# Altium project SmartHaloFF.PrjPcb (part 1 of 2)
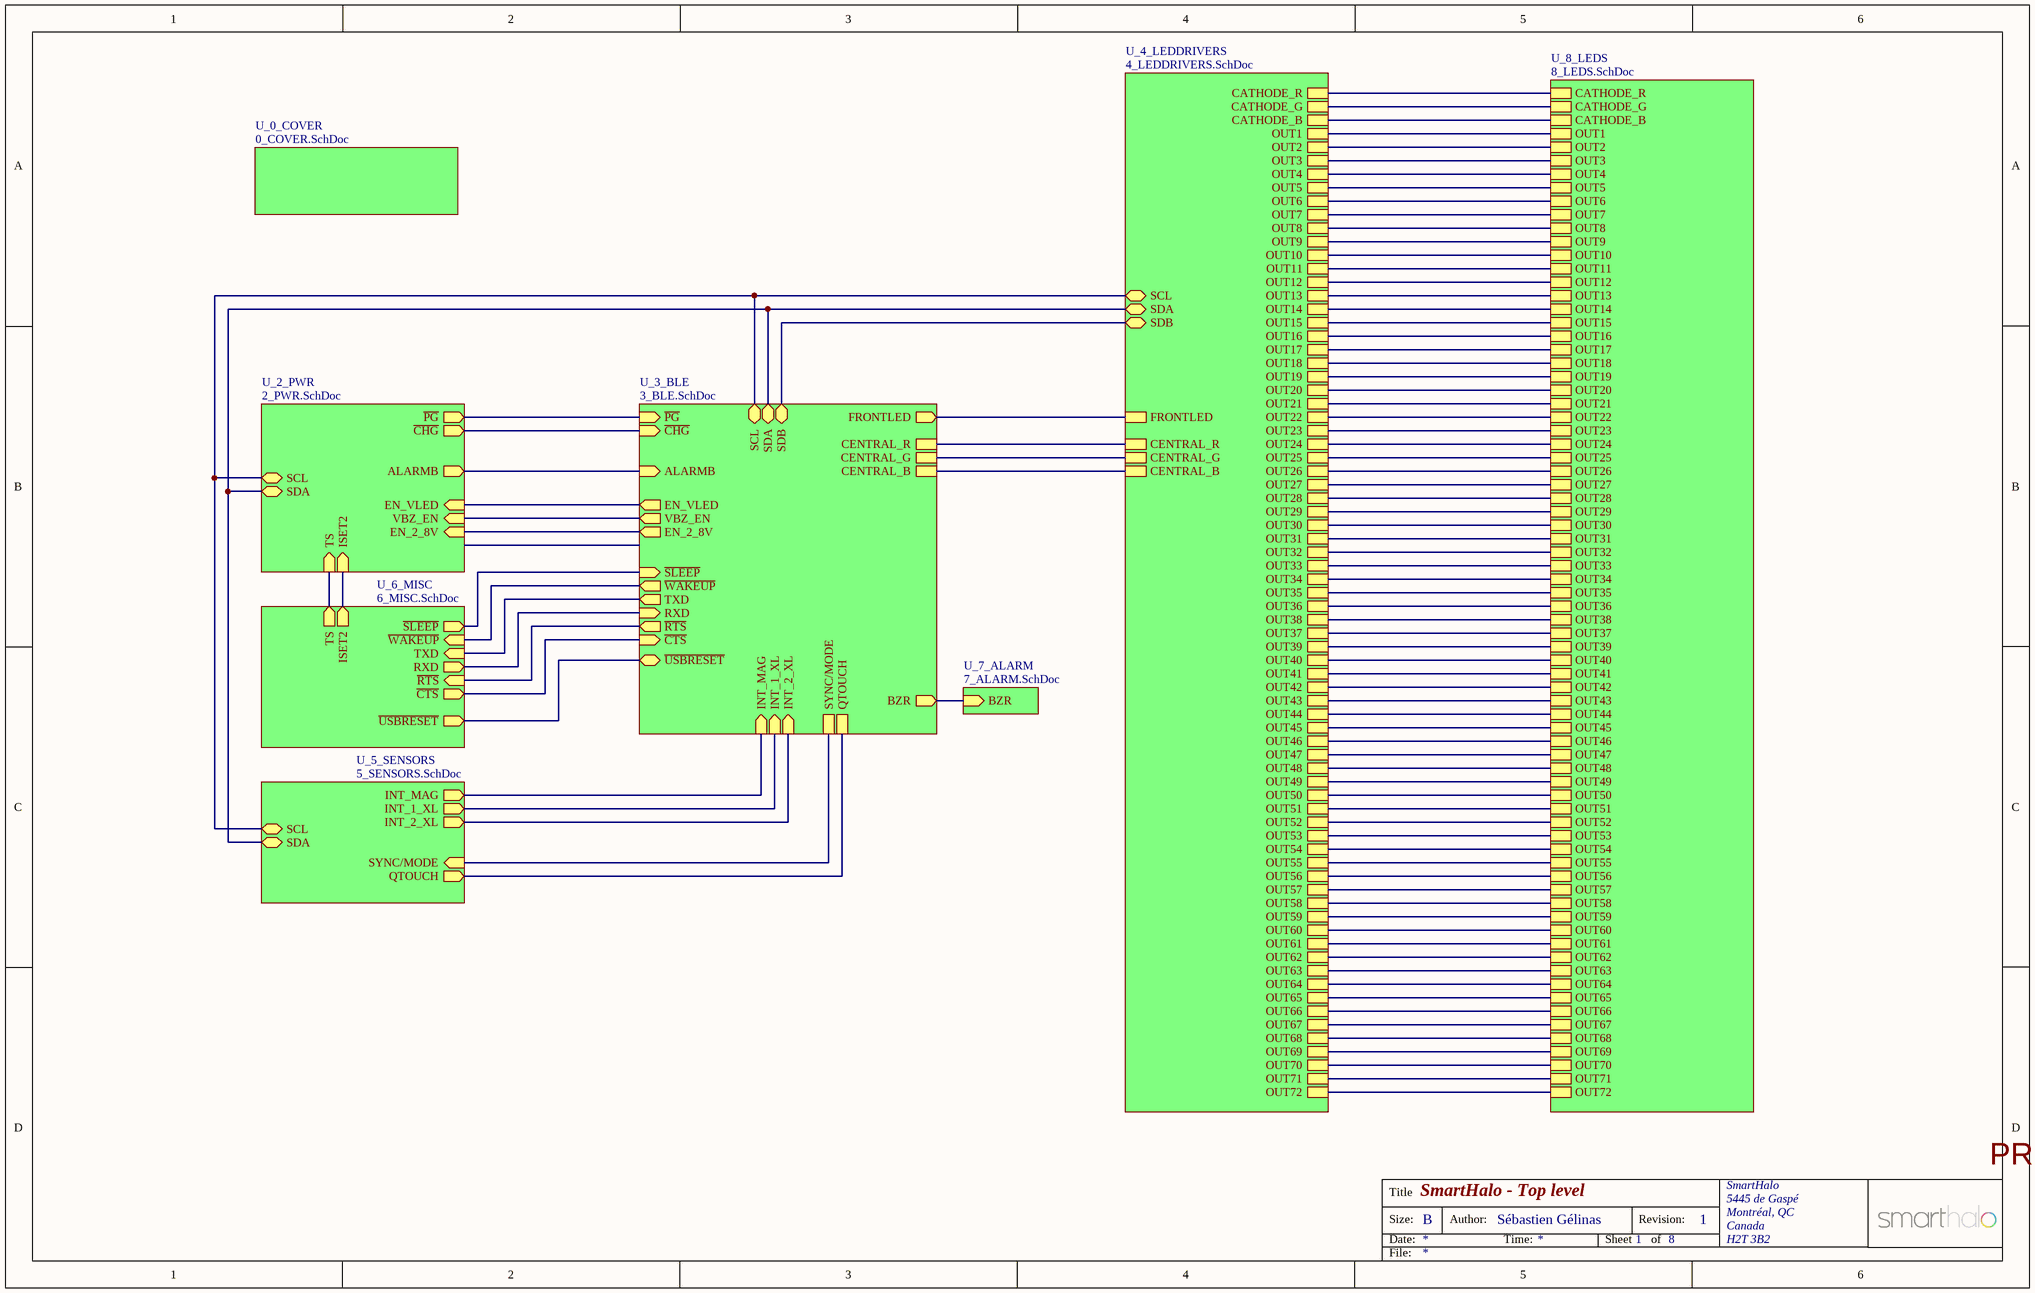
[diagram p0: 1_TOP.SchDoc]
ApprovedBy: Olivier Bourbonnais
9 sheets, 370 parts. Net scope: hierarchical (ports join the sheet entries above them; power ports are global).
Board file: SmartHaloFF.PcbDoc
Sheets:
  1_TOP.SchDoc
    U_2_PWR = 2_PWR.SchDoc
    U_3_BLE = 3_BLE.SchDoc
    U_4_LEDDRIVERS = 4_LEDDRIVERS.SchDoc
    U_5_SENSORS = 5_SENSORS.SchDoc
    U_6_MISC = 6_MISC.SchDoc
    U_7_ALARM = 7_ALARM.SchDoc
    U_8_LEDS = 8_LEDS.SchDoc
    U_0_COVER = 0_COVER.SchDoc

## Sheet 1_TOP.SchDoc: SmartHalo - Top level
size B; Author: Sébastien Gélinas; Organization: SmartHalo; Address1: 5445 de Gaspé; Address2: Montréal, QC; Address3: Canada; Address4: H2T 3B2; DocumentNumber: 1; Revision: 1; SheetNumber: 1; SheetTotal: 8

### Sub-sheets
U_0_COVER = 0_COVER.SchDoc: no entries
U_2_PWR = 2_PWR.SchDoc: VBZ_EN (in), ISET2 (in), ~{PG} (out), ~{CHG} (out), EN_VLED (in), EN_2_8V (in), SCL (bidir), SDA (bidir), ALARMB (out), TS (in)
U_3_BLE = 3_BLE.SchDoc: SDA (bidir), SDB (bidir), BZR (out), FRONTLED (out), SCL (bidir), VBZ_EN (out), ~{CHG} (in), ~{PG} (in), ~{WAKEUP} (out), EN_VLED (out), EN_2_8V (out), QTOUCH, ALARMB (in), CENTRAL_R, CENTRAL_G, CENTRAL_B, INT_MAG (in), INT_1_XL (in), INT_2_XL (in), SYNC/MODE, ~{SLEEP} (in), RXD (in), TXD (out), ~{CTS} (in), ~{RTS} (out), ~{USBRESET}
U_4_LEDDRIVERS = 4_LEDDRIVERS.SchDoc: FRONTLED, SDA (bidir), SDB (bidir), SCL (bidir), CATHODE_B, CATHODE_G, CATHODE_R, OUT1, OUT2, OUT3, OUT4, OUT5, OUT6, OUT7, OUT8, OUT9, OUT10, OUT11, OUT12, OUT13, OUT14, OUT15, OUT16, OUT17, OUT18, OUT19, OUT20, OUT21, OUT22, OUT23, OUT24, OUT25, OUT26, OUT27, OUT28, OUT29, OUT30, OUT31, OUT32, OUT33, OUT34, OUT35, OUT36, OUT38, OUT37, OUT39, OUT40, OUT41, OUT42, OUT43, OUT44, OUT45, OUT46, OUT47, OUT48, OUT49, OUT50, OUT51, OUT52, OUT53, OUT54, OUT55, OUT56, OUT57, OUT58, OUT59, OUT60, OUT61, OUT62, OUT63, OUT64, OUT65, OUT66, OUT67, OUT69, OUT70, OUT71, OUT72, OUT68, CENTRAL_R, CENTRAL_G, CENTRAL_B
U_5_SENSORS = 5_SENSORS.SchDoc: SCL (bidir), SDA (bidir), INT_MAG (out), INT_2_XL (out), QTOUCH (out), SYNC/MODE (in), INT_1_XL (out)
U_6_MISC = 6_MISC.SchDoc: TXD (in), RXD (out), ~{WAKEUP} (in), ~{CTS} (out), ~{RTS} (in), ISET2 (out), TS (out), ~{USBRESET} (out), ~{SLEEP} (out)
U_7_ALARM = 7_ALARM.SchDoc: BZR (in)
U_8_LEDS = 8_LEDS.SchDoc: CATHODE_B, CATHODE_G, CATHODE_R, OUT1, OUT2, OUT3, OUT4, OUT5, OUT6, OUT7, OUT8, OUT9, OUT10, OUT11, OUT12, OUT13, OUT14, OUT15, OUT16, OUT17, OUT18, OUT19, OUT20, OUT21, OUT22, OUT23, OUT24, OUT25, OUT26, OUT27, OUT28, OUT29, OUT30, OUT31, OUT32, OUT33, OUT34, OUT35, OUT36, OUT38, OUT37, OUT39, OUT40, OUT41, OUT42, OUT43, OUT44, OUT45, OUT46, OUT47, OUT48, OUT49, OUT50, OUT51, OUT52, OUT53, OUT54, OUT55, OUT56, OUT57, OUT58, OUT59, OUT60, OUT61, OUT62, OUT63, OUT64, OUT65, OUT66, OUT67, OUT69, OUT70, OUT71, OUT72, OUT68

### Nets
ALARMB: sheet U_2_PWR/ALARMB, sheet U_3_BLE/ALARMB
BCD1: sheet U_2_PWR/ISET2, sheet U_6_MISC/ISET2
BZR: sheet U_3_BLE/BZR, sheet U_7_ALARM/BZR
~{CHG}: sheet U_2_PWR/~{CHG}, sheet U_3_BLE/~{CHG}
CATHODE_B: sheet U_4_LEDDRIVERS/CATHODE_B, sheet U_8_LEDS/CATHODE_B
CATHODE_G: sheet U_4_LEDDRIVERS/CATHODE_G, sheet U_8_LEDS/CATHODE_G
CATHODE_R: sheet U_4_LEDDRIVERS/CATHODE_R, sheet U_8_LEDS/CATHODE_R
CENTRAL_B: sheet U_3_BLE/CENTRAL_B, sheet U_4_LEDDRIVERS/CENTRAL_B
CENTRAL_G: sheet U_3_BLE/CENTRAL_G, sheet U_4_LEDDRIVERS/CENTRAL_G
CENTRAL_R: sheet U_3_BLE/CENTRAL_R, sheet U_4_LEDDRIVERS/CENTRAL_R
CTS: sheet U_3_BLE/~{CTS}, sheet U_6_MISC/~{CTS}
EN_2_8V: sheet U_2_PWR/EN_2_8V, sheet U_3_BLE/EN_2_8V
EN_VLED: sheet U_2_PWR/EN_VLED, sheet U_3_BLE/EN_VLED
FRONTLED: sheet U_3_BLE/FRONTLED, sheet U_4_LEDDRIVERS/FRONTLED
INT_1_XL: sheet U_3_BLE/INT_1_XL, sheet U_5_SENSORS/INT_1_XL
INT_2_XL: sheet U_3_BLE/INT_2_XL, sheet U_5_SENSORS/INT_2_XL
INT_MAG: sheet U_3_BLE/INT_MAG, sheet U_5_SENSORS/INT_MAG
OUT1: sheet U_4_LEDDRIVERS/OUT1, sheet U_8_LEDS/OUT1
OUT2: sheet U_4_LEDDRIVERS/OUT2, sheet U_8_LEDS/OUT2
OUT3: sheet U_4_LEDDRIVERS/OUT3, sheet U_8_LEDS/OUT3
OUT4: sheet U_4_LEDDRIVERS/OUT4, sheet U_8_LEDS/OUT4
OUT5: sheet U_4_LEDDRIVERS/OUT5, sheet U_8_LEDS/OUT5
OUT6: sheet U_4_LEDDRIVERS/OUT6, sheet U_8_LEDS/OUT6
OUT7: sheet U_4_LEDDRIVERS/OUT7, sheet U_8_LEDS/OUT7
OUT8: sheet U_4_LEDDRIVERS/OUT8, sheet U_8_LEDS/OUT8
OUT9: sheet U_4_LEDDRIVERS/OUT9, sheet U_8_LEDS/OUT9
OUT10: sheet U_4_LEDDRIVERS/OUT10, sheet U_8_LEDS/OUT10
OUT11: sheet U_4_LEDDRIVERS/OUT11, sheet U_8_LEDS/OUT11
OUT12: sheet U_4_LEDDRIVERS/OUT12, sheet U_8_LEDS/OUT12
OUT13: sheet U_4_LEDDRIVERS/OUT13, sheet U_8_LEDS/OUT13
OUT14: sheet U_4_LEDDRIVERS/OUT14, sheet U_8_LEDS/OUT14
OUT15: sheet U_4_LEDDRIVERS/OUT15, sheet U_8_LEDS/OUT15
OUT16: sheet U_4_LEDDRIVERS/OUT16, sheet U_8_LEDS/OUT16
OUT17: sheet U_4_LEDDRIVERS/OUT17, sheet U_8_LEDS/OUT17
OUT18: sheet U_4_LEDDRIVERS/OUT18, sheet U_8_LEDS/OUT18
OUT19: sheet U_4_LEDDRIVERS/OUT19, sheet U_8_LEDS/OUT19
OUT20: sheet U_4_LEDDRIVERS/OUT20, sheet U_8_LEDS/OUT20
OUT21: sheet U_4_LEDDRIVERS/OUT21, sheet U_8_LEDS/OUT21
OUT22: sheet U_4_LEDDRIVERS/OUT22, sheet U_8_LEDS/OUT22
OUT23: sheet U_4_LEDDRIVERS/OUT23, sheet U_8_LEDS/OUT23
OUT24: sheet U_4_LEDDRIVERS/OUT24, sheet U_8_LEDS/OUT24
OUT25: sheet U_4_LEDDRIVERS/OUT25, sheet U_8_LEDS/OUT25
OUT26: sheet U_4_LEDDRIVERS/OUT26, sheet U_8_LEDS/OUT26
OUT27: sheet U_4_LEDDRIVERS/OUT27, sheet U_8_LEDS/OUT27
OUT28: sheet U_4_LEDDRIVERS/OUT28, sheet U_8_LEDS/OUT28
OUT29: sheet U_4_LEDDRIVERS/OUT29, sheet U_8_LEDS/OUT29
OUT30: sheet U_4_LEDDRIVERS/OUT30, sheet U_8_LEDS/OUT30
OUT31: sheet U_4_LEDDRIVERS/OUT31, sheet U_8_LEDS/OUT31
OUT32: sheet U_4_LEDDRIVERS/OUT32, sheet U_8_LEDS/OUT32
OUT33: sheet U_4_LEDDRIVERS/OUT33, sheet U_8_LEDS/OUT33
OUT34: sheet U_4_LEDDRIVERS/OUT34, sheet U_8_LEDS/OUT34
OUT35: sheet U_4_LEDDRIVERS/OUT35, sheet U_8_LEDS/OUT35
OUT36: sheet U_4_LEDDRIVERS/OUT36, sheet U_8_LEDS/OUT36
OUT37: sheet U_4_LEDDRIVERS/OUT37, sheet U_8_LEDS/OUT37
OUT38: sheet U_4_LEDDRIVERS/OUT38, sheet U_8_LEDS/OUT38
OUT39: sheet U_4_LEDDRIVERS/OUT39, sheet U_8_LEDS/OUT39
OUT40: sheet U_4_LEDDRIVERS/OUT40, sheet U_8_LEDS/OUT40
OUT41: sheet U_4_LEDDRIVERS/OUT41, sheet U_8_LEDS/OUT41
OUT42: sheet U_4_LEDDRIVERS/OUT42, sheet U_8_LEDS/OUT42
OUT43: sheet U_4_LEDDRIVERS/OUT43, sheet U_8_LEDS/OUT43
OUT44: sheet U_4_LEDDRIVERS/OUT44, sheet U_8_LEDS/OUT44
OUT45: sheet U_4_LEDDRIVERS/OUT45, sheet U_8_LEDS/OUT45
OUT46: sheet U_4_LEDDRIVERS/OUT46, sheet U_8_LEDS/OUT46
OUT47: sheet U_4_LEDDRIVERS/OUT47, sheet U_8_LEDS/OUT47
OUT48: sheet U_4_LEDDRIVERS/OUT48, sheet U_8_LEDS/OUT48
OUT49: sheet U_4_LEDDRIVERS/OUT49, sheet U_8_LEDS/OUT49
OUT50: sheet U_4_LEDDRIVERS/OUT50, sheet U_8_LEDS/OUT50
OUT51: sheet U_4_LEDDRIVERS/OUT51, sheet U_8_LEDS/OUT51
OUT52: sheet U_4_LEDDRIVERS/OUT52, sheet U_8_LEDS/OUT52
OUT53: sheet U_4_LEDDRIVERS/OUT53, sheet U_8_LEDS/OUT53
OUT54: sheet U_4_LEDDRIVERS/OUT54, sheet U_8_LEDS/OUT54
OUT55: sheet U_4_LEDDRIVERS/OUT55, sheet U_8_LEDS/OUT55
OUT56: sheet U_4_LEDDRIVERS/OUT56, sheet U_8_LEDS/OUT56
OUT57: sheet U_4_LEDDRIVERS/OUT57, sheet U_8_LEDS/OUT57
OUT58: sheet U_4_LEDDRIVERS/OUT58, sheet U_8_LEDS/OUT58
OUT59: sheet U_4_LEDDRIVERS/OUT59, sheet U_8_LEDS/OUT59
OUT60: sheet U_4_LEDDRIVERS/OUT60, sheet U_8_LEDS/OUT60
OUT61: sheet U_4_LEDDRIVERS/OUT61, sheet U_8_LEDS/OUT61
OUT62: sheet U_4_LEDDRIVERS/OUT62, sheet U_8_LEDS/OUT62
OUT63: sheet U_4_LEDDRIVERS/OUT63, sheet U_8_LEDS/OUT63
OUT64: sheet U_4_LEDDRIVERS/OUT64, sheet U_8_LEDS/OUT64
OUT65: sheet U_4_LEDDRIVERS/OUT65, sheet U_8_LEDS/OUT65
OUT66: sheet U_4_LEDDRIVERS/OUT66, sheet U_8_LEDS/OUT66
OUT67: sheet U_4_LEDDRIVERS/OUT67, sheet U_8_LEDS/OUT67
OUT68: sheet U_4_LEDDRIVERS/OUT68, sheet U_8_LEDS/OUT68
OUT69: sheet U_4_LEDDRIVERS/OUT69, sheet U_8_LEDS/OUT69
OUT70: sheet U_4_LEDDRIVERS/OUT70, sheet U_8_LEDS/OUT70
OUT71: sheet U_4_LEDDRIVERS/OUT71, sheet U_8_LEDS/OUT71
OUT72: sheet U_4_LEDDRIVERS/OUT72, sheet U_8_LEDS/OUT72
~{PG}: sheet U_2_PWR/~{PG}, sheet U_3_BLE/~{PG}
QTOUCH: sheet U_3_BLE/QTOUCH, sheet U_5_SENSORS/QTOUCH
RTS: sheet U_3_BLE/~{RTS}, sheet U_6_MISC/~{RTS}
RXD: sheet U_3_BLE/RXD, sheet U_6_MISC/RXD
~{SLEEP}: sheet U_3_BLE/~{SLEEP}, sheet U_6_MISC/~{SLEEP}
SCL: sheet U_2_PWR/SCL, sheet U_3_BLE/SCL, sheet U_4_LEDDRIVERS/SCL, sheet U_5_SENSORS/SCL
SDA: sheet U_2_PWR/SDA, sheet U_3_BLE/SDA, sheet U_4_LEDDRIVERS/SDA, sheet U_5_SENSORS/SDA
SDB: sheet U_3_BLE/SDB, sheet U_4_LEDDRIVERS/SDB
SYNC/MODE: sheet U_3_BLE/SYNC/MODE, sheet U_5_SENSORS/SYNC/MODE
TS: sheet U_2_PWR/TS, sheet U_6_MISC/TS
TXD: sheet U_3_BLE/TXD, sheet U_6_MISC/TXD
~{USBRESET}: sheet U_3_BLE/~{USBRESET}, sheet U_6_MISC/~{USBRESET}
VBZ_EN: sheet U_2_PWR/VBZ_EN, sheet U_3_BLE/VBZ_EN
~{WAKEUP}: sheet U_3_BLE/~{WAKEUP}, sheet U_6_MISC/~{WAKEUP}

### Notes on the sheet
- PRELIMINARY: DO NOT USE FOR PRODUCTION
- Title
- Size:
- Date:
- B
- Author:
- Time:
- Sheet
- Revision:
- of
- File:

## Sheet 2_PWR.SchDoc: SmartHalo - Power Supply
size B; Author: Sébastien Gélinas; Organization: SmartHalo; Address1: 5445 de Gaspé; Address2: Montréal, QC; Address3: Canada; Address4: H2T 3B2; DocumentNumber: 1; Revision: 1; SheetNumber: 2; SheetTotal: 8
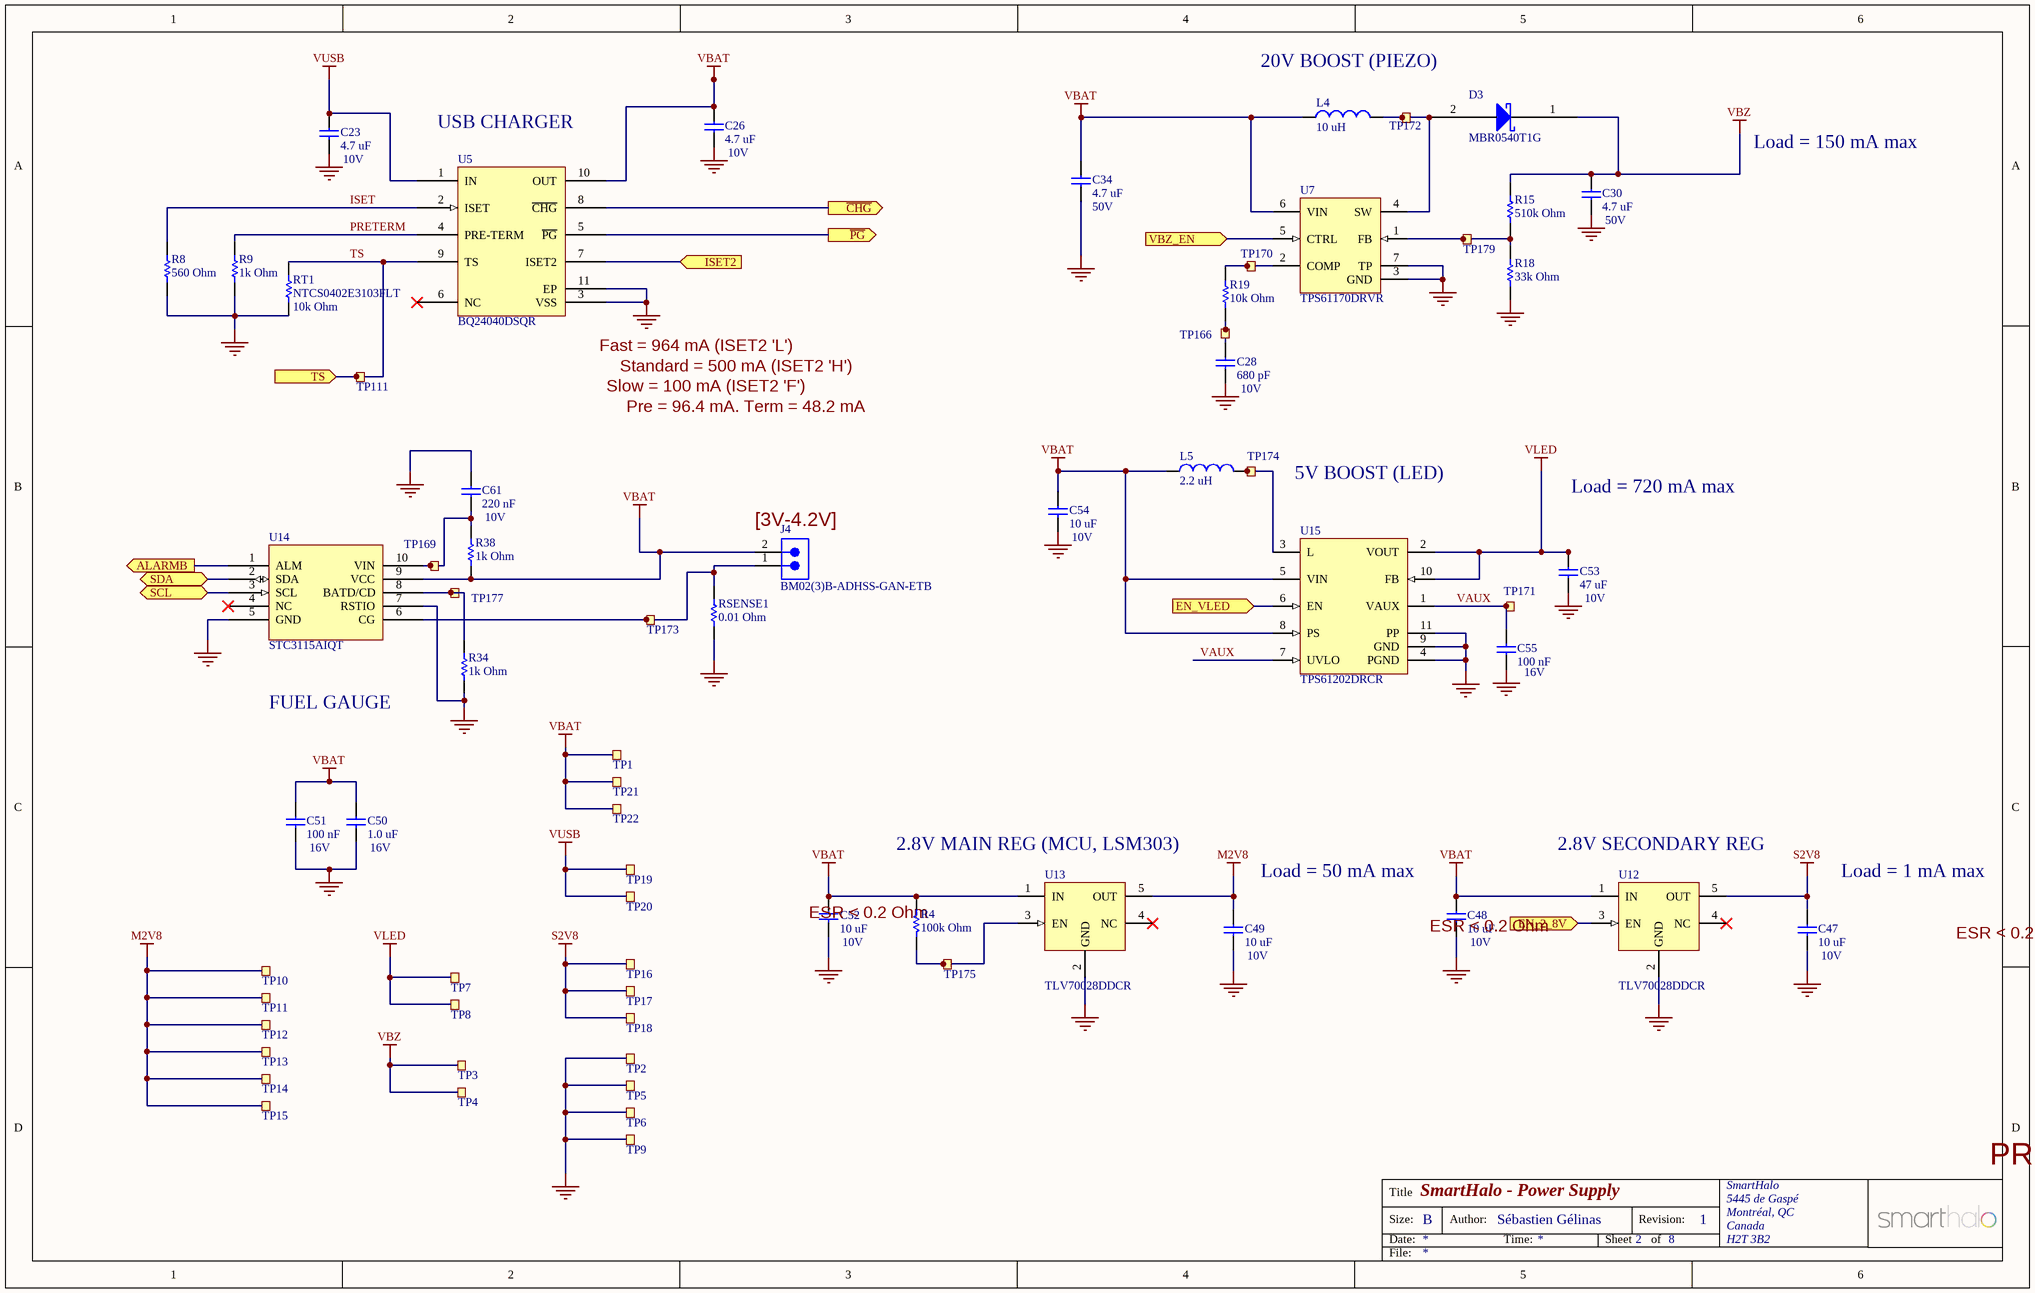
[diagram p1: 2_PWR.SchDoc]

### Parts
C23  4.7 uF  Voltage Rating: 10V  [Varitron_CAP0603]
C26  4.7 uF  Voltage Rating: 10V  [Varitron_CAP0603]
C28  680 pF  Voltage Rating: 10V  [Varitron_CAP0402]
C30  4.7 uF  Voltage Rating: 50V  [Varitron_CAP0805]
C34  4.7 uF  Voltage Rating: 50V  [Varitron_CAP0805]
C47  10 uF  Voltage Rating: 10V  [Varitron_CAP0805]
C48  10 uF  Voltage Rating: 10V  [Varitron_CAP0805]
C49  10 uF  Voltage Rating: 10V  [Varitron_CAP0805]
C50  1.0 uF  Voltage Rating: 16V  [Varitron_CAP0603]
C51  100 nF  Voltage Rating: 16V  [Varitron_CAP0402]
C52  10 uF  Voltage Rating: 10V  [Varitron_CAP0805]
C53  47 uF  Voltage Rating: 10V  [Varitron_CAP1206]
C54  10 uF  Voltage Rating: 10V  [Varitron_CAP0805]
C55  100 nF  Voltage Rating: 16V  [Varitron_CAP0402]
C61  220 nF  Voltage Rating: 10V  [Varitron_CAP0402]
D3  MBR0540T1G  [ONSC-SOD-123-2-425-04_V]
J4  BM02(3)B-ADHSS-GAN-ETB  [BM02(3)B-ADHSS-GAN-ETB]
L4  10 uH  [SRN5020-100M]
L5  2.2 uH  [SRN3015-2R2M]
R4  100k Ohm  [Varitron_RES0402]
R8  560 Ohm  [Varitron_RES0402]
R9  1k Ohm  [Varitron_RES0402]
R15  510k Ohm  [Varitron_RES0402]
R18  33k Ohm  [Varitron_RES0402]
R19  10k Ohm  [Varitron_RES0402]
R34  1k Ohm  [Varitron_RES0402]
R38  1k Ohm  [Varitron_RES0402]
RSENSE1  0.01 Ohm  [Varitron_RES0805]
RT1  NTCS0402E3103FLT  value 10k Ohm  [Varitron_RES0402]
TP1  TP1  [TESTPAD-TH-35mils]  (value not drawn)  (no BOM)
TP2  TP2  [TESTPAD-TH-1_5mm]  (value not drawn)  (no BOM)
TP3  TP3  [TESTPAD-TH-1_5mm]  (value not drawn)  (no BOM)
TP4  TP4  [TESTPAD-TH-35mils]  (value not drawn)  (no BOM)
TP5  TP5  [TESTPAD-TH-1_5mm]  (value not drawn)  (no BOM)
TP6  TP6  [TESTPAD-TH-1_5mm]  (value not drawn)  (no BOM)
TP7  TP7  [TESTPAD-TH-1_5mm]  (value not drawn)  (no BOM)
TP8  TP8  [TESTPAD-TH-1_5mm]  (value not drawn)  (no BOM)
TP9  TP9  [TESTPAD-TH-1_5mm]  (value not drawn)  (no BOM)
TP10  TP10  [TESTPAD-TH-1_5mm]  (value not drawn)  (no BOM)
TP11  TP11  [TESTPAD-TH-1_5mm]  (value not drawn)  (no BOM)
TP12  TP12  [TESTPAD-TH-35mils]  (value not drawn)  (no BOM)
TP13  TP13  [TESTPAD-TH-35mils]  (value not drawn)  (no BOM)
TP14  TP14  [TESTPAD-TH-35mils]  (value not drawn)  (no BOM)
TP15  TP15  [TESTPAD-TH-35mils]  (value not drawn)  (no BOM)
TP16  TP16  [TESTPAD-TH-1_5mm]  (value not drawn)  (no BOM)
TP17  TP17  [TESTPAD-TH-35mils]  (value not drawn)  (no BOM)
TP18  TP18  [TESTPAD-TH-1_5mm]  (value not drawn)  (no BOM)
TP19  TP19  [TESTPAD-TH-1_5mm]  (value not drawn)  (no BOM)
TP20  TP20  [TESTPAD-TH-35mils]  (value not drawn)  (no BOM)
TP21  TP21  [TESTPAD-TH-1_5mm]  (value not drawn)  (no BOM)
TP22  TP22  [TESTPAD-TH-35mils]  (value not drawn)  (no BOM)
TP111  TP111  [TESTPAD-TH-35mils]  (value not drawn)  (no BOM)
TP166  TP166  [TESTPAD-TH-35mils]  (value not drawn)  (no BOM)
TP169  TP169  [TESTPAD-TH-35mils]  (value not drawn)  (no BOM)
TP170  TP170  [TESTPAD-TH-35mils]  (value not drawn)  (no BOM)
TP171  TP171  [TESTPAD-TH-35mils]  (value not drawn)  (no BOM)
TP172  TP172  [TESTPAD-TH-35mils]  (value not drawn)  (no BOM)
TP173  TP173  [TESTPAD-TH-35mils]  (value not drawn)  (no BOM)
TP174  TP174  [TESTPAD-TH-35mils]  (value not drawn)  (no BOM)
TP175  TP175  [TESTPAD-TH-35mils]  (value not drawn)  (no BOM)
TP177  TP177  [TESTPAD-TH-35mils]  (value not drawn)  (no BOM)
TP179  TP179  [TESTPAD-TH-35mils]  (value not drawn)  (no BOM)
U5  BQ24040DSQR  [DSQ10-1500X900TP]
U7  TPS61170DRVR  [DRV6-1600X1000TP]
U12  TLV70028DDCR  [SOT23-5_N]
U13  TLV70028DDCR  [SOT23-5_N]
U14  STC3115AIQT  [DFN10]
U15  TPS61202DRCR  [DRC10-2400X1650TP]

### Ports
ALARMB (out), EN_2_8V (in), EN_VLED (in), ISET2 (in), SCL (bidir), SDA (bidir), TS (in), VBZ_EN (in), ~{CHG} (out), ~{PG} (out)

### Nets
GND: C23.2 C26.2 C28.2 C30.2 C34.2 C47.2 C48.2 C49.2 C50.2 C51.2 C52.2 C53.2 C54.2 C55.2 C61.2 J4.0(ASSY) R8.2 R9.2 R18.1 R34.1 RSENSE1.1 RT1.1 TP2.1 TP5.1 TP6.1 TP9.1 U5.3(VSS) U5.11(EP) U7.3(GND) U7.7(TP) U12.2(GND) U13.2(GND) U14.5(GND) U14.7(RSTIO) U15.4(PGND) U15.9(GND) U15.11(PP)
M2V8: C49.1 TP10.1 TP11.1 TP12.1 TP13.1 TP14.1 TP15.1 U13.5(OUT)  [project net VDD_nRF]
S2V8: C47.1 TP16.1 TP17.1 TP18.1 U12.5(OUT)
VBAT: C26.1 C34.1 C48.1 C50.1 C51.1 C52.1 C54.1 J4.2 L4.1 L5.1 R4.2 R38.1 TP1.1 TP21.1 TP22.1 U5.10(OUT) U7.6(VIN) U12.1(IN) U13.1(IN) U14.9(VCC) U15.5(VIN) U15.8(PS)
VBZ: C30.1 D3.1(Cathode) R15.2 TP3.1 TP4.1
VLED: C53.1 TP7.1 TP8.1 U15.2(VOUT) U15.10(FB)
VUSB: C23.1 TP19.1 TP20.1 U5.1(IN)
ALARMB: U14.1(ALM) ; port ALARMB
BCD1: U5.7(ISET2) ; port ISET2
~{CHG}: U5.8(~{CHG}) ; port ~{CHG}
EN_2_8V: U12.3(EN) ; port EN_2_8V
EN_VLED: U15.6(EN) ; port EN_VLED
ISET: R8.1 U5.2(ISET)
~{PG}: U5.5(~{PG}) ; port ~{PG}
PRETERM: R9.1 U5.4(PRE-TERM)
SCL: U14.3(SCL) ; port SCL
SDA: U14.2(SDA) ; port SDA
TS: RT1.2 TP111.1 U5.9(TS) ; port TS
VAUX: C55.1 TP171.1 U15.1(VAUX) U15.7(UVLO)
VBZ_EN: U7.5(CTRL) ; port VBZ_EN
NetC28_1: C28.1 R19.2 TP166.1
NetC61_1: C61.1 R38.2 TP169.1 U14.10(VIN)
NetD3_2: D3.2(Anode) L4.2 TP172.1 U7.4(SW)
NetJ4_1: J4.1 RSENSE1.2 TP173.1 U14.6(CG)
NetL5_2: L5.2 TP174.1 U15.3(L)
NetR4_1: R4.1 TP175.1 U13.3(EN)
NetR15_1: R15.1 R18.2 TP179.1 U7.1(FB)
NetR19_1: R19.1 TP170.1 U7.2(COMP)
NetR34_2: R34.2 TP177.1 U14.8(BATD/CD)

Not connected (* = marked no-connect by the designer): U5 6(NC)*; U12 4(NC)*; U13 4(NC)*; U14 4(NC)*

### Notes on the sheet
- 20V BOOST (PIEZO)
- (near U5) USB CHARGER
- Load = 150 mA max
- Fast = 964 mA (ISET2 'L')
- (near TP111) Standard = 500 mA (ISET2 'H')
- (near TP111) Slow = 100 mA (ISET2 'F')
- (near TP111) Pre = 96.4 mA. Term = 48.2 mA
- 5V BOOST (LED)
- Load = 720 mA max
- (near J4) [3V-4.2V]
- FUEL GAUGE
- 2.8V MAIN REG (MCU, LSM303)
- Load = 50 mA max
- (near U12) 2.8V SECONDARY REG
- Load = 1 mA max
- (near C52) ESR < 0.2 Ohm
- (near C48) ESR < 0.2 Ohm
- (near C47) ESR < 0.2 Ohm
- PRELIMINARY: DO NOT USE FOR PRODUCTION
- Title
- Size:
- Date:
- B
- Author:
- Time:
- Sheet
- Revision:
- of
- File:

### Library data of the parts
C23 C26 = Varitron_CAP0603: 4.7 uF 10V X5R 10% 0603 (1608 Metric)  SMD; Manufacturer: Yageo; Manufacturer Part Number: CC0603KRX5R6BB475; SmartHalo Part Number: 630009-01; Case-EIA: 0603; Case-Metric: 1608; Final: N; Tolerance: 10%; Technology: SMT; Temperature Coefficient: X5R; Part Number: CC0603KRX5R6BB475; Value: 4.7 uF; Supplier: Arrow Electronics; Footprint Name: 0603
C28 = Varitron_CAP0402: 680 pF 10V X7R 10% 0402 (1005 Metric)  SMD; Manufacturer: Yageo; Manufacturer Part Number: CC0402JPX7R9BB681; SmartHalo Part Number: 630011-01; Case-EIA: 0402; Case-Metric: 1005; Final: N; Tolerance: 10%; Technology: SMT; Temperature Coefficient: X7R; Part Number: CC0402JPX7R9BB681; Value: 680 pF; Supplier: Arrow Electronics; Footprint Name: 0402
C30 C34 = Varitron_CAP0805: 4.7 uF 50V X5R 10% 0805 (2012 Metric)  SMD; Manufacturer: Samsung; Manufacturer Part Number: CL21A475KBQNNNE; SmartHalo Part Number: 630010-01; Case-EIA: 0805; Case-Metric: 2012; Final: N; Tolerance: 10%; Technology: SMT; Temperature Coefficient: X5R; Part Number: CL21A475KBQNNNE; Value: 4.7 uF; Supplier: Arrow Electronics; Footprint Name: 0805
C47-C49 C52 C54 = Varitron_CAP0805: 10 uF 10V X7R 10% 0805 (2012 Metric)  SMD; Manufacturer: Samsung; Manufacturer Part Number: CL21B106KPQNNNE; SmartHalo Part Number: 630013-01; Case-EIA: 0805; Case-Metric: 2012; Final: N; Tolerance: 10%; Technology: SMT; Temperature Coefficient: X7R; Part Number: CL21B106KPQNNNE; Value: 10 uF; Supplier: Arrow Electronics; Footprint Name: 0805
C50 = Varitron_CAP0603: 1.0 uF 16V X7R 10% 0603 (1608 Metric)  SMD; Manufacturer: Samsung; Manufacturer Part Number: CL10B105KO8NNNC; SmartHalo Part Number: 630002-01; Case-EIA: 0603; Case-Metric: 1608; Final: N; Tolerance: 10%; Technology: SMT; Temperature Coefficient: X7R; Part Number: CL10B105KO8NNNC; Value: 1.0 uF; Supplier: Arrow Electronics; Footprint Name: 0603
C51 C55 = Varitron_CAP0402: 100 nF 16V X7R 10% 0402 (1005 Metric)  SMD; Manufacturer: Samsung; Manufacturer Part Number: CL05B104KO5NNNC; SmartHalo Part Number: 630003-01; Case-EIA: 0402; Case-Metric: 1005; Final: N; Tolerance: 10%; Technology: SMT; Temperature Coefficient: X7R; Part Number: CL05B104KO5NNNC; Value: 100 nF; Supplier: Arrow Electronics; Footprint Name: 0402
C53 = Varitron_CAP1206: 47 uF 10V X5R 10% 1206 (3216 Metric)  SMD; Manufacturer: Murata; Manufacturer Part Number: GRM31CR61A476KE15L; SmartHalo Part Number: 630015-01; Case-EIA: 1206; Case-Metric: 3216; Final: N; Tolerance: 10%; Technology: SMT; Temperature Coefficient: X5R; Part Number: GRM31CR61A476KE15L; Value: 47 uF; Supplier: Arrow Electronics; Footprint Name: 1206
C61 = Varitron_CAP0402: 220 nF 10V X7R 10% 0402 (1005 Metric)  SMD; Manufacturer: Samsung; Manufacturer Part Number: CL05B224KP5NNNC; SmartHalo Part Number: 630014-01; Case-EIA: 0402; Case-Metric: 1005; Final: N; Tolerance: 10%; Technology: SMT; Temperature Coefficient: X7R; Part Number: CL05B224KP5NNNC; Value: 220 nF; Supplier: Arrow Electronics; Footprint Name: 0402
D3 = MBR0540T1G: Schottky Power Rectifier, 2-Pin SOD-123, Pb-Free, Tape and Reel; Manufacturer: ON Semiconductor; SmartHalo Part Number: 630017-01; Final: Y; Manufacturer Part Number: MBR0540T1G; Part Number: MBR0540T1G; Footprint Name: SOD123; Supplier: Arrow Electronics
J4 = BM02(3)B-ADHSS-GAN-ETB: Connector, 1.3 mm pitch; Manufacturer: JST; SmartHalo Part Number: 630021-01; Final: Y; Manufacturer Part Number: BM02(3)B-ADHSS-GAN-ETB; Part Number: BM02(3)B-ADHSS-GAN-ETB; Footprint Name: CUSTOM(ADH Connector 2 pins); Supplier: Arrow Electronics
L4 = SRN5020-100M: Inductor, 10 uH, 20%, 144 mOhm DCR, 1.3A; Manufacturer: Bourns; SmartHalo Part Number: 630027-01; Final: Y; Manufacturer Part Number: SRN5020-100M; Part Number: SRN5020-100M; Value: 10 uH; Tolerance: 20%; DCR: 144 mOhm; Saturation Current: 1.3A; Footprint Name: IND5020; Supplier: Arrow Electronics
L5 = SRN3015-2R2M: Inductor, 2.2 uH, 20%, 72 mOhm DCR, 1.65A; Manufacturer: Bourns; SmartHalo Part Number: 630028-01; DCR: 72 mOhm; Final: Y; Manufacturer Part Number: SRN3015-2R2M; Part Number: SRN3015-2R2M; Value: 2.2 uH; Tolerance: 20%; Saturation Current: 1.65A; Footprint Name: IND3015; Supplier: Arrow Electronics
R4 = Varitron_RES0402: 100k 0.063W 5%  0402 (1005 Metric)  SMD; Manufacturer: Samsung; Manufacturer Part Number: RC1005J104CS; SmartHalo Part Number: 630036-01; Case-Metric: 1005; Case-EIA: 0402; Final: N; Tolerance: 5%; Technology: SMT; Power: 0.063W; Part Number: RC1005J104CS; Value: 100k Ohm; Footprint Name: 0402; Supplier: Arrow Electronics
R8 = Varitron_RES0402: 560R 0.063W 5%  0402 (1005 Metric)  SMD; Manufacturer: Samsung; Manufacturer Part Number: RC1005J561CS; SmartHalo Part Number: 630039-01; Case-Metric: 1005; Case-EIA: 0402; Final: N; Tolerance: 5%; Technology: SMT; Power: 0.063W; Part Number: RC1005J561CS; Value: 560 Ohm; Footprint Name: 0402; Supplier: Arrow Electronics
R9 R34 R38 = Varitron_RES0402: 1k 0.063W 5%  0402 (1005 Metric)  SMD; Manufacturer: Samsung; Manufacturer Part Number: RC1005J102CS; SmartHalo Part Number: 630040-01; Case-Metric: 1005; Case-EIA: 0402; Final: N; Tolerance: 5%; Technology: SMT; Power: 0.063W; Part Number: RC1005J102CS; Value: 1k Ohm; Footprint Name: 0402; Supplier: Arrow Electronics
R15 = Varitron_RES0402: 510k 0.063W 5%  0402 (1005 Metric)  SMD; Manufacturer: Samsung; Manufacturer Part Number: RC1005J514CS; SmartHalo Part Number: 630043-01; Case-Metric: 1005; Case-EIA: 0402; Final: N; Tolerance: 5%; Technology: SMT; Power: 0.063W; Part Number: RC1005J514CS; Value: 510k Ohm; Footprint Name: 0402; Supplier: Arrow Electronics
R18 = Varitron_RES0402: 33k 0.063W 5%  0402 (1005 Metric)  SMD; Manufacturer: Samsung; Manufacturer Part Number: RC1005J333CS; SmartHalo Part Number: 630045-01; Case-Metric: 1005; Case-EIA: 0402; Final: N; Tolerance: 5%; Technology: SMT; Power: 0.063W; Part Number: RC1005J333CS; Value: 33k Ohm; Footprint Name: 0402; Supplier: Arrow Electronics
R19 = Varitron_RES0402: 10k 0.063W 5%  0402 (1005 Metric)  SMD; Manufacturer: Samsung; Manufacturer Part Number: RC1005J103CS; SmartHalo Part Number: 630041-01; Case-Metric: 1005; Case-EIA: 0402; Final: N; Tolerance: 5%; Technology: SMT; Power: 0.063W; Part Number: RC1005J103CS; Value: 10k Ohm; Footprint Name: 0402; Supplier: Arrow Electronics
RSENSE1 = Varitron_RES0805: 0R01 0.25W 1%  0805 (2012 Metric)  SMD; Manufacturer: TT Electronics; Manufacturer Part Number: LRMAM0805-R01FT4; SmartHalo Part Number: 630049-01; 2nd Manufacturer Part Number: WSL0805R0100FEA18; 2nd Manufacturer: Vishay; Case-Metric: 2012; Case-EIA: 0805; Final: N; Tolerance: 1%; Technology: SMT; Power: 0.25W; Part Number: LRMAM0805-R01FT4; Value: 0.01 Ohm; Footprint Name: 0805; Supplier: Arrow Electronics
RT1 = NTCS0402E3103FLT: Thermistor NTC 0402, R0 10k, 1%, B 3490, SMD; Manufacturer: Vishay; SmartHalo Part Number: 630050-01; Case-Metric: 1005; Case-EIA: 0402; Beta: 3490; Final: N; Tolerance: 1%; Technology: SMT; Part Number: NTCS0402E3103FLT; Manufacturer Part Number: NTCS0402E3103FLT; Footprint Name: 0402; Supplier: Arrow Electronics
TP1 TP4 TP12-TP15 TP17 TP20 TP22 TP111 TP166 TP169-TP175 TP177 TP179 = TESTPAD_TH_35mils: Testpoint, through hole, 35 mils; Value: TP
TP2 TP3 TP5-TP11 TP16 TP18 TP19 TP21 = TESTPAD_TH_1_5MM: Testpoint, through hole, 1.5mm; Value: TP
U5 = BQ24040DSQR: 800 mA, Single-Input, Single Cell Li-Ion Battery Charger with Auto Start. Vovp=6.6 V, 3.5 V, -40 to 85 degC, 10-pin SON (DSQ), Green (RoHS & no Sb/Br); Manufacturer: Texas Instruments; SmartHalo Part Number: 630055-01; Final: Y; Manufacturer Part Number: BQ24040DSQR; Part Number: BQ24040DSQR; Footprint Name: WSON10; Supplier: Arrow Electronics
U7 = TPS61170DRVR: Boost Voltage Converter with 3 to 18 V Input and 3 to 38 V Output, -40 to 85 degC, 6-Pin SON (DRC), Green (RoHS & no Sb/Br); Manufacturer: Texas Instruments; SmartHalo Part Number: 630056-01; Final: Y; Part Number: TPS61170DRVR; Manufacturer Part Number: TPS61170DRVR; Footprint Name: SON6; Supplier: Arrow Electronics
U12 U13 = TLV70028DDCR: 200 mA Low Dropout Regulator, 2 - 5.5V Input, Fixed 2.8V Output; Manufacturer: Texas Instruments; SmartHalo Part Number: 630060-01; Final: Y; Part Number: TLV70028DDCR; Manufacturer Part Number: TLV70028DDCR; Footprint Name: SOT23-5; Supplier: Arrow Electronics
U14 = STC3115AIQT: IC Battery Fuel Gauge for 1-Cell Lithium-ion (Li+); Manufacturer: ST Microelectronics; SmartHalo Part Number: 630061-01; Final: Y; Manufacturer Part Number: STC3115AIQT; Part Number: STC3115AIQT; Footprint Name: DFN10; Supplier: Arrow Electronics
U15 = TPS61202DRCR: Boost Voltage Converter with 0.3 to 5.5 V Input and 5 V Output, -40 to 85 degC, 10-Pin SON (DRC), Green (RoHS & no Sb/Br); Manufacturer: Texas Instruments; SmartHalo Part Number: 630062-01; Final: Y; Part Number: TPS61202DRCR; Manufacturer Part Number: TPS61202DRCR; Footprint Name: SON10; Supplier: Arrow Electronics

## Sheet 3_BLE.SchDoc: SmartHalo - Radio
size B; Author: Sébastien Gélinas; Organization: SmartHalo; Address1: 5445 de Gaspé; Address2: Montréal, QC; Address3: Canada; Address4: H2T 3B2; DocumentNumber: 4; Revision: 1; SheetNumber: 3; SheetTotal: 8
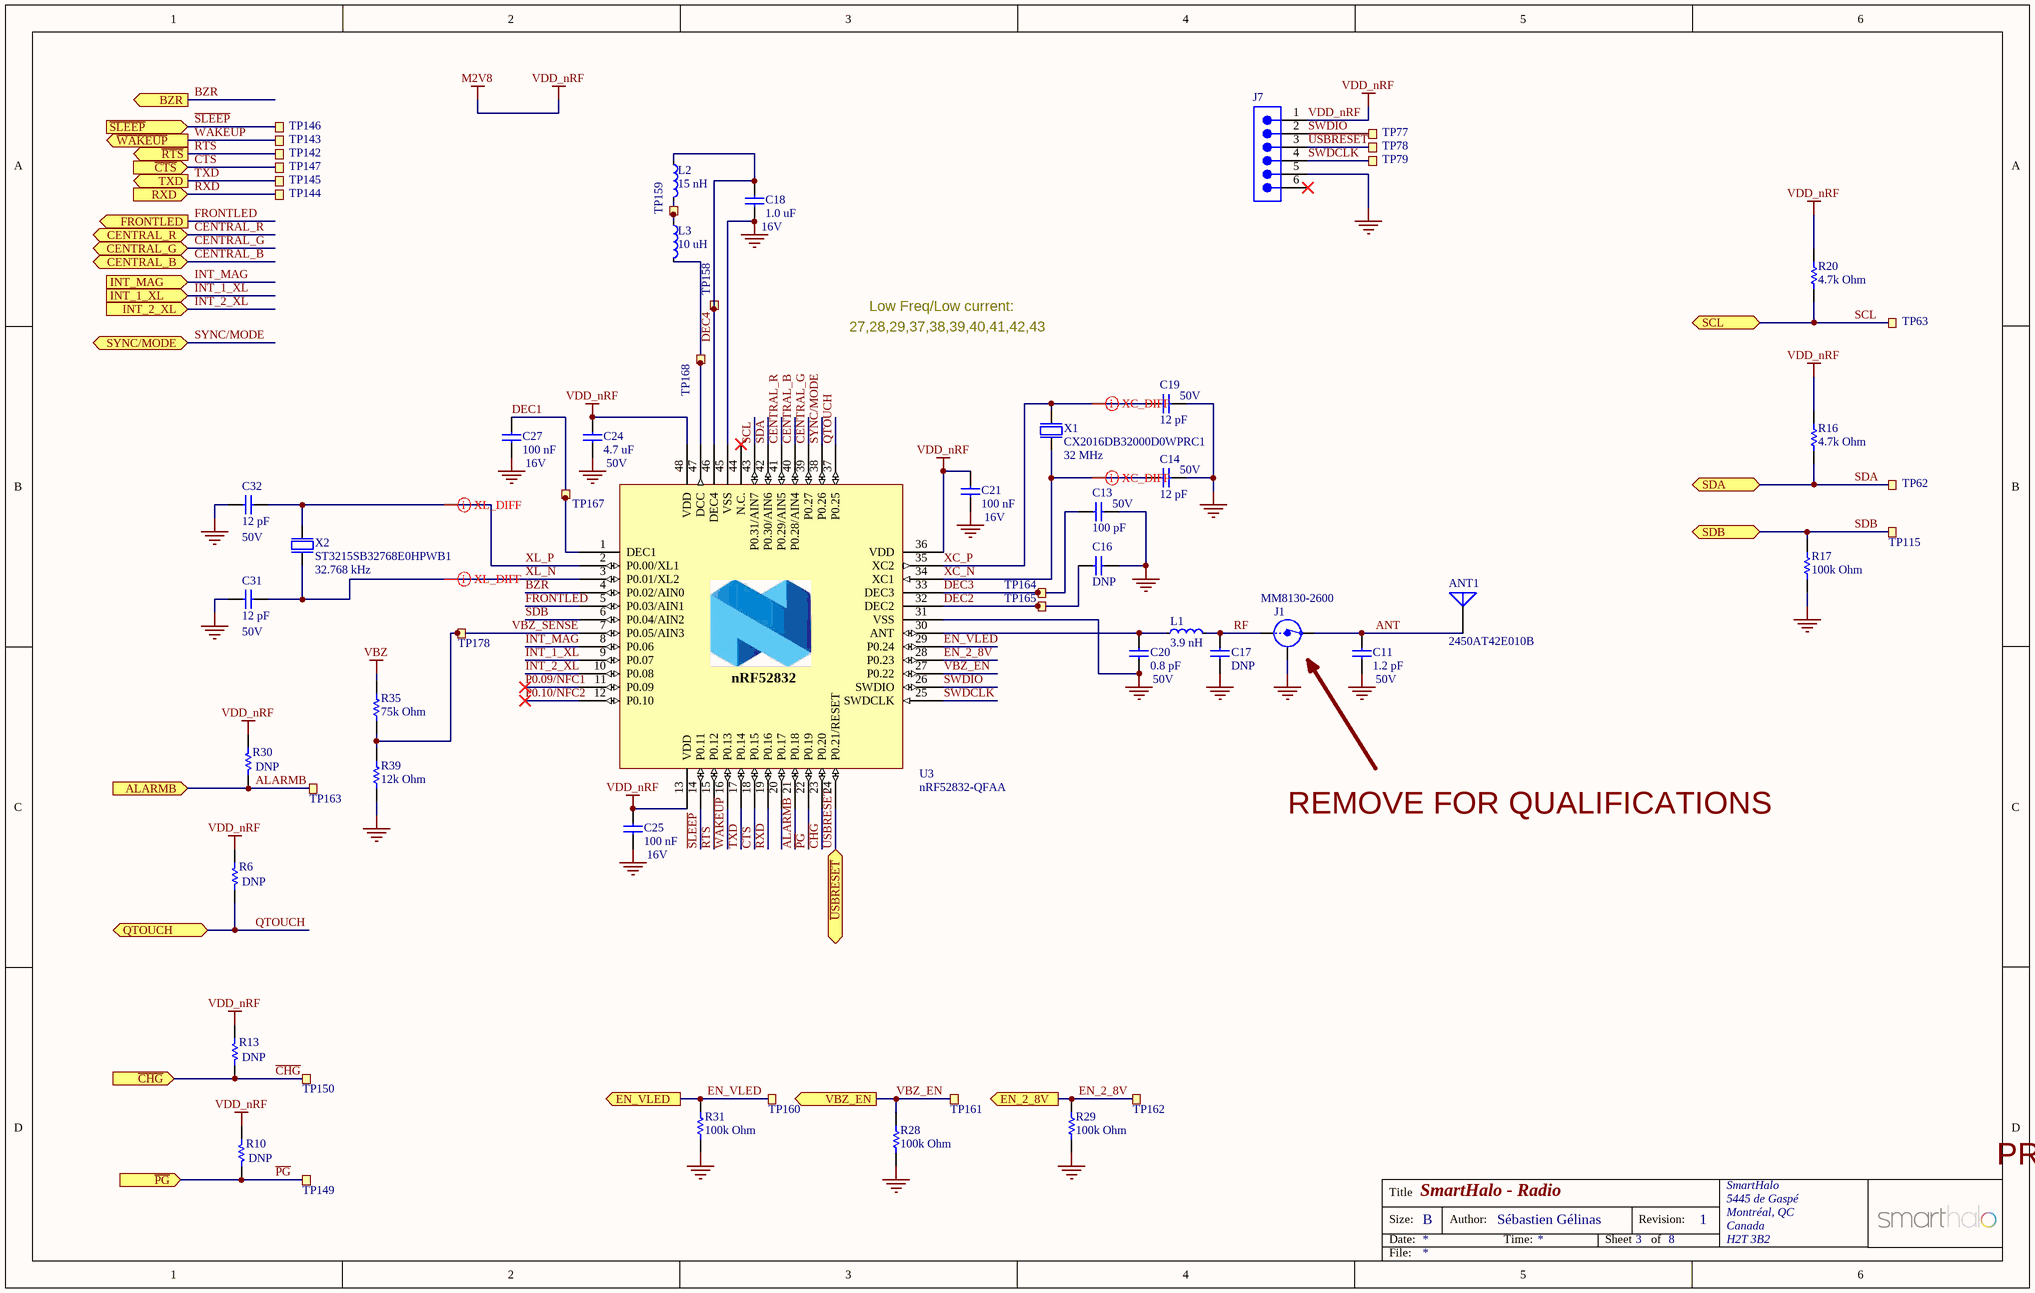
[diagram p2: 3_BLE.SchDoc]

### Parts
ANT1  2450AT42E010B  [2450AT42E010B]
C11  1.2 pF  Voltage Rating: 50V  [Varitron_CAP0402]
C13  100 pF  Voltage Rating: 50V  [Varitron_CAP0402]
C14  12 pF  Voltage Rating: 50V  [Varitron_CAP0402]
C16  DNP  [Varitron_CAP0402]  (no BOM)
C17  DNP  [Varitron_CAP0402]  (no BOM)
C18  1.0 uF  Voltage Rating: 16V  [Varitron_CAP0603]
C19  12 pF  Voltage Rating: 50V  [Varitron_CAP0402]
C20  0.8 pF  Voltage Rating: 50V  [Varitron_CAP0402]
C21  100 nF  Voltage Rating: 16V  [Varitron_CAP0402]
C24  4.7 uF  Voltage Rating: 50V  [Varitron_CAP0805]
C25  100 nF  Voltage Rating: 16V  [Varitron_CAP0402]
C27  100 nF  Voltage Rating: 16V  [Varitron_CAP0402]
C31  12 pF  Voltage Rating: 50V  [Varitron_CAP0402]
C32  12 pF  Voltage Rating: 50V  [Varitron_CAP0402]
J1  MM8130-2600  [COAXIAL-SWF]
J7  (no value)  [JLINK_6PIN_NEEDLE_ADAPTER]  (no BOM)
L1  3.9 nH  [Varitron_IND0402]
L2  15 nH  [Varitron_IND0402]
L3  10 uH  [Varitron_IND0603]
R6  DNP  [Varitron_RES0402]  (no BOM)
R10  DNP  [Varitron_RES0402]  (no BOM)
R13  DNP  [Varitron_RES0402]  (no BOM)
R16  4.7k Ohm  [Varitron_RES0402]
R17  100k Ohm  [Varitron_RES0402]
R20  4.7k Ohm  [Varitron_RES0402]
R28  100k Ohm  [Varitron_RES0402]
R29  100k Ohm  [Varitron_RES0402]
R30  DNP  [Varitron_RES0402]  (no BOM)
R31  100k Ohm  [Varitron_RES0402]
R35  75k Ohm  [Varitron_RES0402]
R39  12k Ohm  [Varitron_RES0402]
TP62  TP62  [TESTPAD-TH-35mils]  (value not drawn)  (no BOM)
TP63  TP63  [TESTPAD-TH-35mils]  (value not drawn)  (no BOM)
TP77  TP77  [TESTPAD-TH-35mils]  (value not drawn)  (no BOM)
TP78  TP78  [TESTPAD-TH-35mils]  (value not drawn)  (no BOM)
TP79  TP79  [TESTPAD-TH-35mils]  (value not drawn)  (no BOM)
TP115  TP115  [TESTPAD-TH-35mils]  (value not drawn)  (no BOM)
TP142  TP142  [TESTPAD-TH-35mils]  (value not drawn)  (no BOM)
TP143  TP143  [TESTPAD-TH-35mils]  (value not drawn)  (no BOM)
TP144  TP144  [TESTPAD-TH-35mils]  (value not drawn)  (no BOM)
TP145  TP145  [TESTPAD-TH-35mils]  (value not drawn)  (no BOM)
TP146  TP146  [TESTPAD-TH-35mils]  (value not drawn)  (no BOM)
TP147  TP147  [TESTPAD-TH-35mils]  (value not drawn)  (no BOM)
TP149  TP149  [TESTPAD-TH-35mils]  (value not drawn)  (no BOM)
TP150  TP150  [TESTPAD-TH-35mils]  (value not drawn)  (no BOM)
TP158  TP158  [TESTPAD-TH-35mils]  (value not drawn)  (no BOM)
TP159  TP159  [TESTPAD-TH-35mils]  (value not drawn)  (no BOM)
TP160  TP160  [TESTPAD-TH-35mils]  (value not drawn)  (no BOM)
TP161  TP161  [TESTPAD-TH-35mils]  (value not drawn)  (no BOM)
TP162  TP162  [TESTPAD-TH-35mils]  (value not drawn)  (no BOM)
TP163  TP163  [TESTPAD-TH-35mils]  (value not drawn)  (no BOM)
TP164  TP164  [TESTPAD-TH-35mils]  (value not drawn)  (no BOM)
TP165  TP165  [TESTPAD-TH-35mils]  (value not drawn)  (no BOM)
TP167  TP167  [TESTPAD-TH-35mils]  (value not drawn)  (no BOM)
TP168  TP168  [TESTPAD-TH-35mils]  (value not drawn)  (no BOM)
TP178  TP178  [TESTPAD-TH-35mils]  (value not drawn)  (no BOM)
U3  nRF52832-QFAA  [QFN40P600X600X90-48N]
X1  CX2016DB32000D0WPRC1  Frequency: 32 MHz  [CRYSTAL_2016_4Pins]
X2  ST3215SB32768E0HPWB1  Frequency: 32.768 kHz  [CRYSTAL_3215_2Pins]

### Ports
ALARMB (in), BZR (out), CENTRAL_B, CENTRAL_G, CENTRAL_R, EN_2_8V (out), EN_VLED (out), FRONTLED (out), INT_1_XL (in), INT_2_XL (in), INT_MAG (in), QTOUCH, RXD (in), SCL (bidir), SDA (bidir), SDB (bidir), SYNC/MODE, TXD (out), VBZ_EN (out), ~{CHG} (in), ~{CTS} (in), ~{PG} (in), ~{RTS} (out), ~{SLEEP} (in), ~{USBRESET}, ~{WAKEUP} (out)

### Nets
GND: ANT1.3(GND) ANT1.4(GND) C11.1 C13.2 C14.2 C16.2 C17.1 C18.2 C19.2 C20.1 C21.2 C24.2 C25.2 C27.2 C31.1 C32.1 J1.2(Shield) J7.5 R17.1 R28.2 R29.1 R31.1 R39.1 U3.31(VSS) U3.45(VSS) U3.49(GND) X1.2(GND) X1.4(GND)
VBZ: R35.2
VDD_nRF: C21.1 C24.1 C25.1 J7.1 R6.2 R10.2 R13.1 R16.2 R20.2 R30.2 U3.13(VDD) U3.36(VDD) U3.48(VDD)  [also labelled M2V8]
ALARMB: R30.1 TP163.1 U3.21(P0.18) ; port ALARMB
ANT: ANT1.1(Feed) C11.2 J1.3(OUT)
BZR: U3.4(P0.02/AIN0) ; port BZR
~{CHG}: R13.2 TP150.1 U3.23(P0.20) ; port ~{CHG}
CENTRAL_B: U3.40(P0.28/AIN4) ; port CENTRAL_B
CENTRAL_G: U3.39(P0.27) ; port CENTRAL_G
CENTRAL_R: U3.41(P0.29/AIN5) ; port CENTRAL_R
CTS: TP147.1 U3.18(P0.15) ; port ~{CTS}
DEC1: C27.1 TP167.1 U3.1(DEC1)
DEC2: C16.1 TP165.1 U3.32(DEC2)
DEC3: C13.1 TP164.1 U3.33(DEC3)
DEC4: C18.1 L2.1 TP158.1 U3.46(DEC4)
EN_2_8V: R29.2 TP162.1 U3.28(P0.23) ; port EN_2_8V
EN_VLED: R31.2 TP160.1 U3.29(P0.24) ; port EN_VLED
FRONTLED: U3.5(P0.03/AIN1) ; port FRONTLED
INT_1_XL: U3.9(P0.07) ; port INT_1_XL
INT_2_XL: U3.10(P0.08) ; port INT_2_XL
INT_MAG: U3.8(P0.06) ; port INT_MAG
P0.09/NFC1: U3.11(P0.09)
P0.10/NFC2: U3.12(P0.10)
~{PG}: R10.1 TP149.1 U3.22(P0.19) ; port ~{PG}
QTOUCH: R6.1 U3.37(P0.25) ; port QTOUCH
RF: C17.2 J1.1(IN) L1.2
RTS: TP142.1 U3.15(P0.12) ; port ~{RTS}
RXD: TP144.1 U3.19(P0.16) ; port RXD
~{SLEEP}: TP146.1 U3.14(P0.11) ; port ~{SLEEP}
SCL: R20.1 TP63.1 U3.43(P0.31/AIN7) ; port SCL
SDA: R16.1 TP62.1 U3.42(P0.30/AIN6) ; port SDA
SDB: R17.2 TP115.1 U3.6(P0.04/AIN2) ; port SDB
SWDCLK: J7.4 TP79.1 U3.25(SWDCLK)
SWDIO: J7.2 TP77.1 U3.26(SWDIO)
SYNC/MODE: U3.38(P0.26) ; port SYNC/MODE
TXD: TP145.1 U3.17(P0.14) ; port TXD
~{USBRESET}: J7.3 TP78.1 U3.24(P0.21/RESET) ; port ~{USBRESET}
VBZ_EN: R28.1 TP161.1 U3.27(P0.22) ; port VBZ_EN
VBZ_SENSE: R35.1 R39.2 TP178.1 U3.7(P0.05/AIN3)
~{WAKEUP}: TP143.1 U3.16(P0.13) ; port ~{WAKEUP}
XC_N: C14.1 U3.34(XC1) X1.3(out)
XC_P: C19.1 U3.35(XC2) X1.1(inp)
XL_N: C31.2 U3.3(P0.01/XL2) X2.2
XL_P: C32.2 U3.2(P0.00/XL1) X2.1
NetC20_2: C20.2 L1.1 U3.30(ANT)
NetL2_2: L2.2 L3.1 TP159.1
NetL3_2: L3.2 TP168.1 U3.47(DCC)

Not connected (* = marked no-connect by the designer): ANT1 2(NC); J7 6*; U3 20(P0.17) 44(N.C.)*

### Layout directives
differential pair: XC_N, XC_P, XL_N, XL_P

### Notes on the sheet
- 27,28,29,37,38,39,40,41,42,43
- Low Freq/Low current:
- REMOVE FOR QUALIFICATIONS
- PRELIMINARY: DO NOT USE FOR PRODUCTION
- Title
- Size:
- Date:
- B
- Author:
- Time:
- Sheet
- Revision:
- of
- File:
- (in symbol nRF52832_QFAA) nRF52832

### Library data of the parts
ANT1 = 2450AT42E010B: CHIP ANTENNA, 2.45GHz, 5 x 2 x 1.5 mm body; Manufacturer: Johanson Technology; SmartHalo Part Number: 630001-01; Final: N; Part Number: 2450AT42E010B; Manufacturer Part Number: 2450AT42E010B; Supplier: Arrow Electronics; Footprint Name: CUSTOM(2 pins)
C11 = Varitron_CAP0402: 1.2 pF 50V NP0 ±0.1 pF 0402 (1005 Metric)  SMD; Manufacturer: Samsung; Manufacturer Part Number: CL05C1R2BB5NNNC; SmartHalo Part Number: 630005-01; Case-EIA: 0402; Case-Metric: 1005; Tolerance: ±0.1 pF; Final: N; Technology: SMT; Temperature Coefficient: NP0; Part Number: CL05C1R2BB5NNNC; Value: 1.2 pF; Supplier: Arrow Electronics; Footprint Name: 0402
C13 = Varitron_CAP0402: 100 pF 50V NP0 5% 0402 (1005 Metric)  SMD; Manufacturer: Yageo; Manufacturer Part Number: CC0402JRNPO9BN101; SmartHalo Part Number: 630006-01; Case-EIA: 0402; Case-Metric: 1005; Final: N; Tolerance: 5%; Technology: SMT; Temperature Coefficient: NP0; Part Number: CC0402JRNPO9BN101; Value: 100 pF; Supplier: Arrow Electronics; Footprint Name: 0402
C14 C19 C31 C32 = Varitron_CAP0402: 12 pF 50V NP0 2% 0402 (1005 Metric)  SMD; Manufacturer: Yageo; Manufacturer Part Number: CC0402GRNPO9BN120; SmartHalo Part Number: 630007-01; Case-EIA: 0402; Case-Metric: 1005; Final: N; Tolerance: 2%; Technology: SMT; Temperature Coefficient: NP0; Part Number: CC0402GRNPO9BN120; Value: 12 pF; Supplier: Arrow Electronics; Footprint Name: 0402
C16 C17 = Varitron_CAP0402: C nF V TEMP TOL% 0402 (1005 Metric)  SMD; Case-EIA: 0402; Case-Metric: 1005; Tolerance: TOL; Value: C nF; Final: N; Technology: SMT; Supplier: Arrow Electronics; Footprint Name: 0402
C18 = Varitron_CAP0603: as C50 on sheet 2_PWR; Tolerance: 10%; Technology: SMT; Temperature Coefficient: X7R; Part Number: CL10B105KO8NNNC; Value: 1.0 uF; Supplier: Arrow Electronics; Footprint Name: 0603
C20 = Varitron_CAP0402: 0.8 pF 50V NP0 ±0.05pF 0402 (1005 Metric)  SMD; Manufacturer: Murata; Manufacturer Part Number: GRM1555C1HR80WA01D; SmartHalo Part Number: 630008-01; Case-EIA: 0402; Case-Metric: 1005; Final: N; Tolerance: ±0.05pF; Technology: SMT; Temperature Coefficient: NP0; Part Number: GRM1555C1HR80WA01D; Value: 0.8 pF; Supplier: Arrow Electronics; Footprint Name: 0402
C21 C25 C27 = Varitron_CAP0402: as C51 on sheet 2_PWR; Tolerance: 10%; Technology: SMT; Temperature Coefficient: X7R; Part Number: CL05B104KO5NNNC; Value: 100 nF; Supplier: Arrow Electronics; Footprint Name: 0402
C24 = Varitron_CAP0805: as C30 on sheet 2_PWR; Tolerance: 10%; Technology: SMT; Temperature Coefficient: X5R; Part Number: CL21A475KBQNNNE; Value: 4.7 uF; Supplier: Arrow Electronics; Footprint Name: 0805
J1 = Coaxial-Internal-SW: Coaxial Connector with Switch; Manufacturer: Murata; 2nd source part number: 81-MM8130-2600RA2; SmartHalo Part Number: 630019-01; Artikkelnr Noca: 55029011; Artikkelnr Simpro: N.A.; Final: N; Part Number: MM8130-2600; Manufacturer Part Number: MM8130-2600; Datasheet: http://www.murata.com/products/catalog/pdf/o33e.pdf; LatestRevisionDate: 2014-04-24; Pin Count: 3; Publisher: Nordic Semiconductor; Published: 2014-04-24; Note: *; Supplier: Digi-Key; Supplier part number: 490-4981-1-ND; 2nd source Supplier: Mouser; Footprint Doc: COAXIAL-SWF; Footprint Name: CUSTOM(6 pins)
J7 = JLINK_6PIN_NEEDLE_ADAPTER: JLink 6 Pin Needle Adapter for Flasher ARM Programmer; Manufacturer: JLink; Supplier: Digikey
L1 = Varitron_IND0402: 3.9 nH ±0.1 nH, 170 mA, 0402 (1005 Metric)  SMD; Manufacturer: Murata; Manufacturer Part Number: LQP15MN3N9B02D; SmartHalo Part Number: 630024-01; Case-EIA: 0402; Case-Metric: 1005; Tolerance: ±0.1 nH; SRF: MHz; DCR: Ohm; Final: N; Technology: SMT; Part Number: LQP15MN3N9B02D; Value: 3.9 nH; Supplier: Arrow Electronics; Footprint Name: 0402
L2 = Varitron_IND0402: 15 nH 5%, 320 mA, 0402 (1005 Metric)  SMD; Manufacturer: Murata; Manufacturer Part Number: LQG15HS15NJ02D; SmartHalo Part Number: 630025-01; Case-EIA: 0402; Case-Metric: 1005; SRF: MHz; DCR: 0.32 Ohm; Q: 8; Final: Y; Tolerance: 5%; Technology: SMT; Part Number: LQG15HS15NJ02D; Value: 15 nH; Supplier: Arrow Electronics; Footprint Name: 0402
L3 = Varitron_IND0603: 10 uH 20%, 400 mA, 0603 (1608 Metric)  SMD; Manufacturer: TDK Corporation; Manufacturer Part Number: GLFR1608T100M-LR; SmartHalo Part Number: 630026-01; Case-EIA: 0603; Case-Metric: 1608; SRF: MHz; DCR: 0.36 Ohm; Final: Y; Tolerance: 20%; Technology: SMT; Part Number: GLFR1608T100M-LR; Value: 10 uH; Supplier: Arrow Electronics; Footprint Name: 0603
R6 R30 = Varitron_RES0402: 100k 0.063W 5%  0402 (1005 Metric)  SMD; Manufacturer: Samsung; Manufacturer Part Number: RC1005J104CS; SmartHalo Part Number: 630036-01; Case-Metric: 1005; Case-EIA: 0402; Value: 100k Ohm; Final: N; Tolerance: 5%; Technology: SMT; Power: 0.063W; Part Number: RC1005J104CS; Footprint Name: 0402; Supplier: Arrow Electronics
R10 R13 = Varitron_RES0402: 10k 0.063W 5%  0402 (1005 Metric)  SMD; Manufacturer: Samsung; Manufacturer Part Number: RC1005J103CS; SmartHalo Part Number: 630041-01; Case-Metric: 1005; Case-EIA: 0402; Value: 10k Ohm; Final: N; Tolerance: 5%; Technology: SMT; Power: 0.063W; Part Number: RC1005J103CS; Footprint Name: 0402; Supplier: Arrow Electronics
R16 R20 = Varitron_RES0402: 4k7 0.063W 5%  0402 (1005 Metric)  SMD; Manufacturer: Samsung; Manufacturer Part Number: RC1005J472CS; SmartHalo Part Number: 630044-01; Case-Metric: 1005; Case-EIA: 0402; Final: N; Tolerance: 5%; Technology: SMT; Power: 0.063W; Part Number: RC1005J472CS; Value: 4.7k Ohm; Footprint Name: 0402; Supplier: Arrow Electronics
R17 R28 R29 R31 = Varitron_RES0402: as R4 on sheet 2_PWR; Tolerance: 5%; Technology: SMT; Power: 0.063W; Part Number: RC1005J104CS; Value: 100k Ohm; Footprint Name: 0402; Supplier: Arrow Electronics
R35 = Varitron_RES0402: 75k 0.063W 5%  0402 (1005 Metric)  SMD; Manufacturer: Samsung; Manufacturer Part Number: RC1005J753CS; SmartHalo Part Number: 630048-01; Case-Metric: 1005; Case-EIA: 0402; Final: N; Tolerance: 5%; Technology: SMT; Power: 0.063W; Part Number: RC1005J753CS; Supplier: Arrow Electronics; Footprint Name: 0402; Value: 75k Ohm
R39 = Varitron_RES0402: 12k 0.063W 5%  0402 (1005 Metric)  SMD; Manufacturer: Samsung; Manufacturer Part Number: RC1005J123CS; SmartHalo Part Number: 630047-01; Case-Metric: 1005; Case-EIA: 0402; Final: N; Tolerance: 5%; Technology: SMT; Power: 0.063W; Part Number: RC1005J123CS; Supplier: Arrow Electronics; Footprint Name: 0402; Value: 12k Ohm
TP62 TP63 TP77-TP79 TP115 TP142-TP147 TP149 TP150 TP158-TP165 TP167 TP168 TP178 = TESTPAD_TH_35mils: as TP1 on sheet 2_PWR
U3 = nRF52832_QFAA: Multi-protocol Bluetooth Low Energy and 2.4GHz proprietary system-on-chip; Manufacturer: Nordic Semiconductor; SmartHalo Part Number: 630053-01; Artikkelnr Noca: N.A.; Final: Y; Part Number: nRF52832-QFAA; Manufacturer Part Number: nRF52832-QFAA; Datasheet: *; LatestRevisionDate: 2014-11-26; Pin Count: 48; Publisher: Nordic Semiconductor; Published: 2014-11-26; Note: *; Supplier: Arrow Electronics; Supplier Part Number: *; 2nd source Supplier: *; 2nd source part number: *; Footprint Doc: QFN-48; Artikkelnr Simpro: N.A.; Footprint Name: QFN48TP
X1 = CX2016DB32000D0WPRC1: XTAL 32 MHz, 8pF, 3.2 x 1.5 mm, ±20 ppm Tol, ±200 ppm Drift; Manufacturer: AVX/Kyocera; SmartHalo Part Number: 630066-01; Frequency Drift: ±40 ppm; Final: Y; Manufacturer Part Number: CX2016DB32000D0WPRC1; Part Number: CX2016DB32000D0WPRC1; Frequency Tolerance: ±40 ppm; Load Capacitance: 8 pF; Supplier: Arrow Electronics; Footprint Name: XTAL2016
X2 = ST3215SB32768E0HPWB1: XTAL 32.768 kHz, 9pF, 3.2 x 1.5 mm, ±20 ppm Tol, ±200 ppm Drift; Manufacturer: AVX/Kyocera; SmartHalo Part Number: 630067-01; Frequency Tolerance: ±20 ppm; Frequency Drift: ±200 ppm; Final: Y; Manufacturer Part Number: ST3215SB32768E0HPWB1; Part Number: ST3215SB32768E0HPWB1; Load Capacitance: 9 pF; Footprint Name: XTAL3215; Supplier: Arrow Electronics

## Sheet 4_LEDDRIVERS.SchDoc: SmartHalo - Led (Drivers)
size B; Author: Sébastien Gélinas; Organization: SmartHalo; Address1: 5445 de Gaspé; Address2: Montréal, QC; Address3: Canada; Address4: H2T 3B2; Revision: 1; SheetNumber: 4; SheetTotal: 8
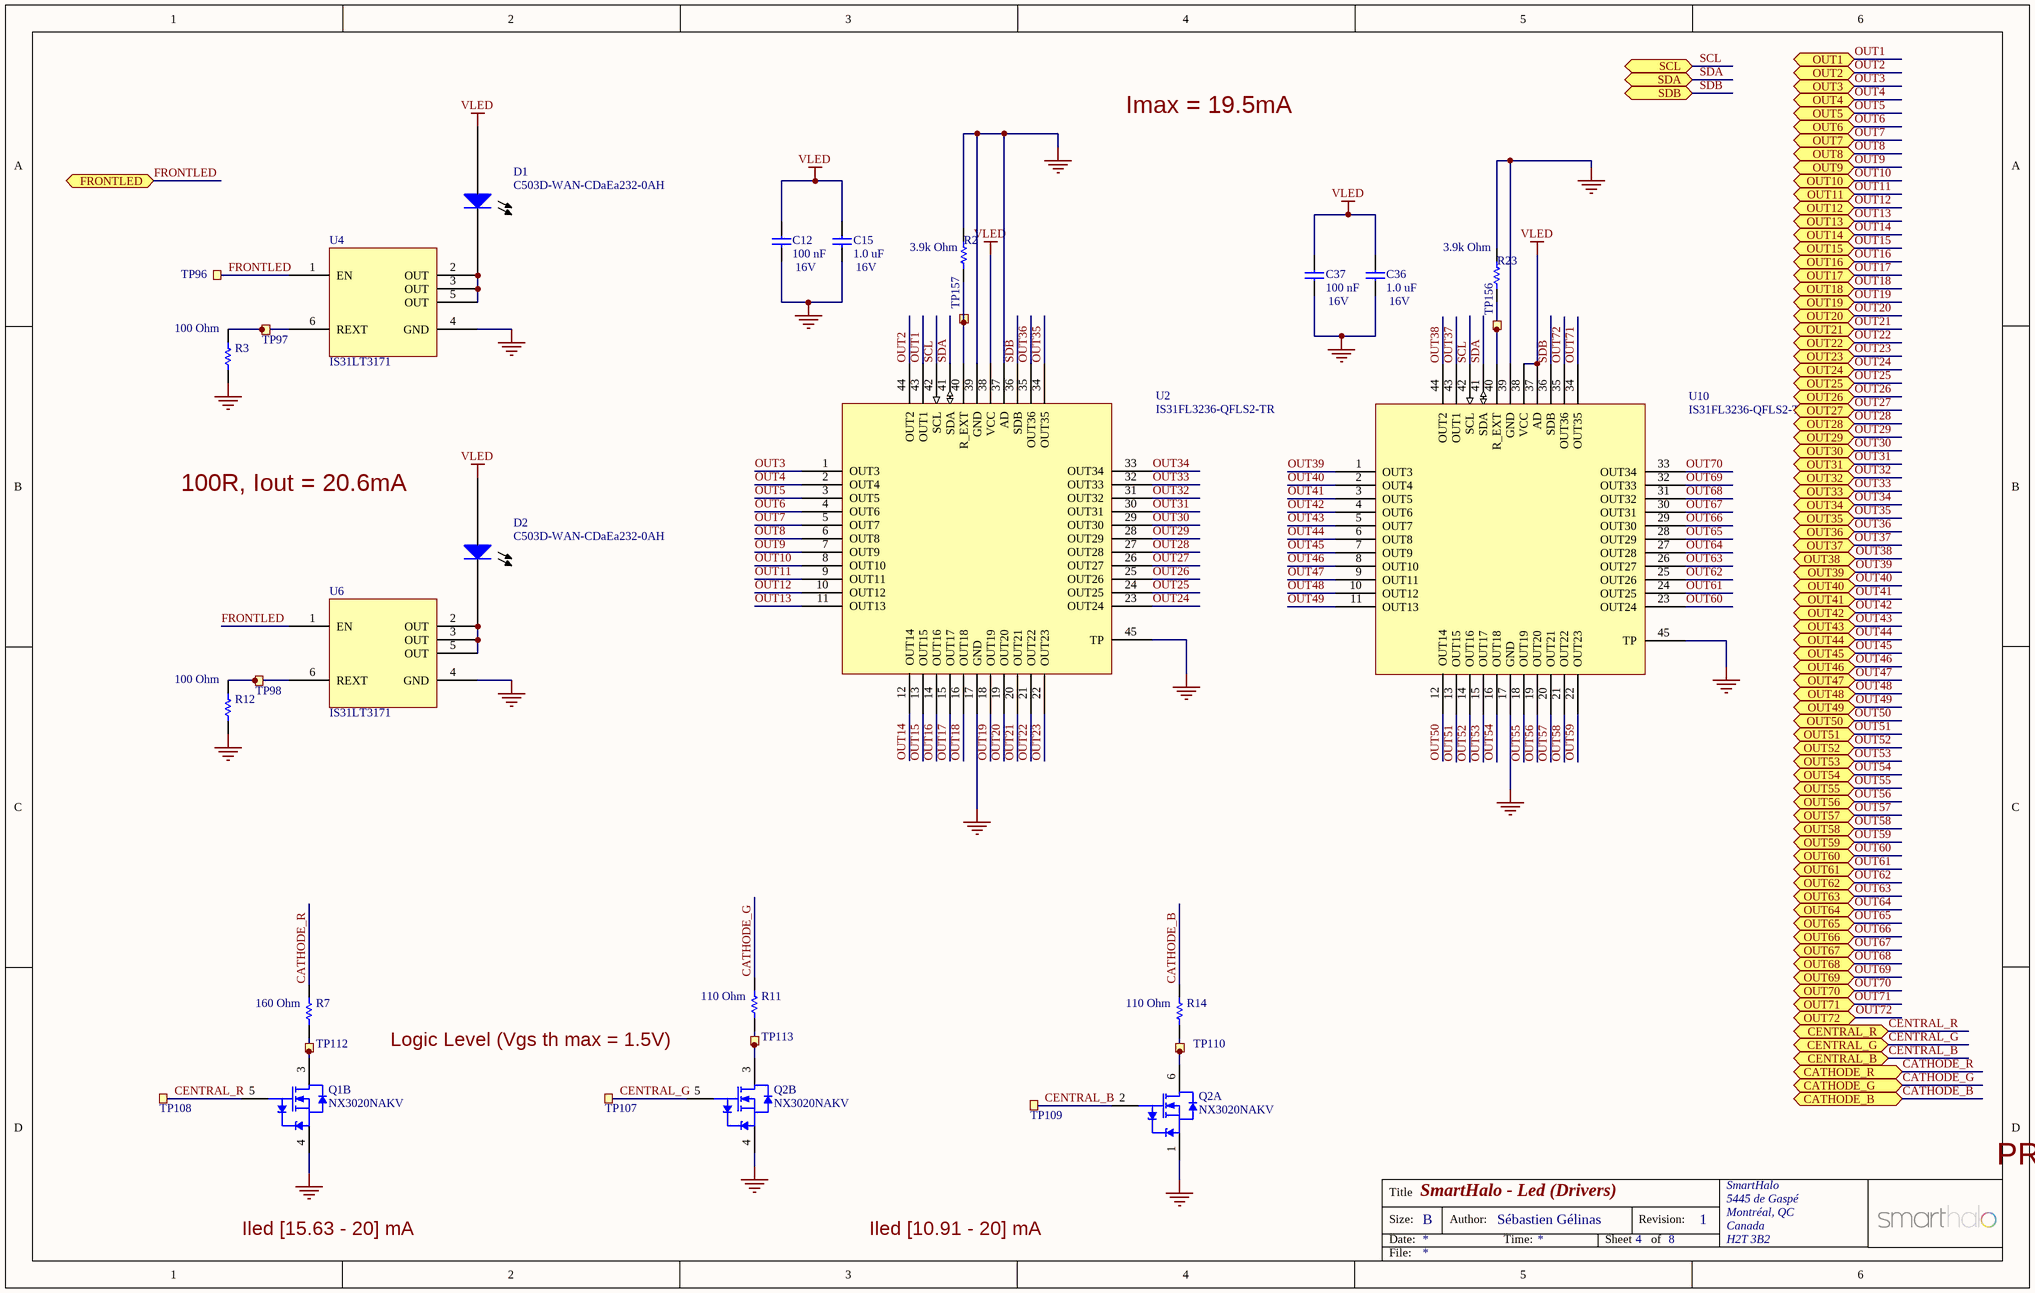
[diagram p3: 4_LEDDRIVERS.SchDoc]

### Parts
C12  100 nF  Voltage Rating: 16V  [Varitron_CAP0402]
C15  1.0 uF  Voltage Rating: 16V  [Varitron_CAP0603]
C36  1.0 uF  Voltage Rating: 16V  [Varitron_CAP0603]
C37  100 nF  Voltage Rating: 16V  [Varitron_CAP0402]
D1  C503D-WAN-CDaEa232-0AH  [FRONTLED_PADS]
D2  C503D-WAN-CDaEa232-0AH  [FRONTLED_PADS]
Q1  NX3020NAKV  [SOT666]  (part B of 2)
Q2  NX3020NAKV  [SOT666]  (parts A,B of 2)
R2  3.9k Ohm  [Varitron_RES0402]
R3  100 Ohm  [Varitron_RES0402]
R7  160 Ohm  [Varitron_RES0402]
R11  110 Ohm  [Varitron_RES0402]
R12  100 Ohm  [Varitron_RES0402]
R14  110 Ohm  [Varitron_RES0402]
R23  3.9k Ohm  [Varitron_RES0402]
TP96  TP96  [TESTPAD-TH-35mils]  (value not drawn)  (no BOM)
TP97  TP97  [TESTPAD-TH-35mils]  (value not drawn)  (no BOM)
TP98  TP98  [TESTPAD-TH-35mils]  (value not drawn)  (no BOM)
TP107  TP107  [TESTPAD-TH-35mils]  (value not drawn)  (no BOM)
TP108  TP108  [TESTPAD-TH-35mils]  (value not drawn)  (no BOM)
TP109  TP109  [TESTPAD-TH-35mils]  (value not drawn)  (no BOM)
TP110  TP110  [TESTPAD-TH-35mils]  (value not drawn)  (no BOM)
TP112  TP112  [TESTPAD-TH-35mils]  (value not drawn)  (no BOM)
TP113  TP113  [TESTPAD-TH-35mils]  (value not drawn)  (no BOM)
TP156  TP156  [TESTPAD-TH-35mils]  (value not drawn)  (no BOM)
TP157  TP157  [TESTPAD-TH-35mils]  (value not drawn)  (no BOM)
U2  IS31FL3236-QFLS2-TR  [QFN-44]
U4  IS31LT3171  [SOT23-6]
U6  IS31LT3171  [SOT23-6]
U10  IS31FL3236-QFLS2-TR  [QFN-44]

### Ports
CATHODE_B, CATHODE_G, CATHODE_R, CENTRAL_B, CENTRAL_G, CENTRAL_R, FRONTLED, OUT1, OUT2, OUT3, OUT4, OUT5, OUT6, OUT7, OUT8, OUT9, OUT10, OUT11, OUT12, OUT13, OUT14, OUT15, OUT16, OUT17, OUT18, OUT19, OUT20, OUT21, OUT22, OUT23, OUT24, OUT25, OUT26, OUT27, OUT28, OUT29, OUT30, OUT31, OUT32, OUT33, OUT34, OUT35, OUT36, OUT37, OUT38, OUT39, OUT40, OUT41, OUT42, OUT43, OUT44, OUT45, OUT46, OUT47, OUT48, OUT49, OUT50, OUT51, OUT52, OUT53, OUT54, OUT55, OUT56, OUT57, OUT58, OUT59, OUT60, OUT61, OUT62, OUT63, OUT64, OUT65, OUT66, OUT67, OUT68, OUT69, OUT70, OUT71, OUT72, SCL (bidir), SDA (bidir), SDB (bidir)

### Nets
GND: C12.2 C15.2 C36.2 C37.2 Q1.4(S2) Q2.1(S1) Q2.4(S2) R2.2 R3.1 R12.1 R23.2 U2.17(GND) U2.37(AD) U2.39(GND) U2.45(TP) U4.4(GND) U6.4(GND) U10.17(GND) U10.39(GND) U10.45(TP)
VLED: C12.1 C15.1 C36.1 C37.1 D1.1(Anode) D2.1(Anode) U2.38(VCC) U10.37(AD) U10.38(VCC)
CATHODE_B: R14.2 ; port CATHODE_B
CATHODE_G: R11.2 ; port CATHODE_G
CATHODE_R: R7.2 ; port CATHODE_R
CENTRAL_B: Q2.2(G1) TP109.1 ; port CENTRAL_B
CENTRAL_G: Q2.5(G2) TP107.1 ; port CENTRAL_G
CENTRAL_R: Q1.5(G2) TP108.1 ; port CENTRAL_R
FRONTLED: TP96.1 U4.1(EN) U6.1(EN) ; port FRONTLED
OUT1: U2.43(OUT1) ; port OUT1
OUT2: U2.44(OUT2) ; port OUT2
OUT3: U2.1(OUT3) ; port OUT3
OUT4: U2.2(OUT4) ; port OUT4
OUT5: U2.3(OUT5) ; port OUT5
OUT6: U2.4(OUT6) ; port OUT6
OUT7: U2.5(OUT7) ; port OUT7
OUT8: U2.6(OUT8) ; port OUT8
OUT9: U2.7(OUT9) ; port OUT9
OUT10: U2.8(OUT10) ; port OUT10
OUT11: U2.9(OUT11) ; port OUT11
OUT12: U2.10(OUT12) ; port OUT12
OUT13: U2.11(OUT13) ; port OUT13
OUT14: U2.12(OUT14) ; port OUT14
OUT15: U2.13(OUT15) ; port OUT15
OUT16: U2.14(OUT16) ; port OUT16
OUT17: U2.15(OUT17) ; port OUT17
OUT18: U2.16(OUT18) ; port OUT18
OUT19: U2.18(OUT19) ; port OUT19
OUT20: U2.19(OUT20) ; port OUT20
OUT21: U2.20(OUT21) ; port OUT21
OUT22: U2.21(OUT22) ; port OUT22
OUT23: U2.22(OUT23) ; port OUT23
OUT24: U2.23(OUT24) ; port OUT24
OUT25: U2.24(OUT25) ; port OUT25
OUT26: U2.25(OUT26) ; port OUT26
OUT27: U2.26(OUT27) ; port OUT27
OUT28: U2.27(OUT28) ; port OUT28
OUT29: U2.28(OUT29) ; port OUT29
OUT30: U2.29(OUT30) ; port OUT30
OUT31: U2.30(OUT31) ; port OUT31
OUT32: U2.31(OUT32) ; port OUT32
OUT33: U2.32(OUT33) ; port OUT33
OUT34: U2.33(OUT34) ; port OUT34
OUT35: U2.34(OUT35) ; port OUT35
OUT36: U2.35(OUT36) ; port OUT36
OUT37: U10.43(OUT1) ; port OUT37
OUT38: U10.44(OUT2) ; port OUT38
OUT39: U10.1(OUT3) ; port OUT39
OUT40: U10.2(OUT4) ; port OUT40
OUT41: U10.3(OUT5) ; port OUT41
OUT42: U10.4(OUT6) ; port OUT42
OUT43: U10.5(OUT7) ; port OUT43
OUT44: U10.6(OUT8) ; port OUT44
OUT45: U10.7(OUT9) ; port OUT45
OUT46: U10.8(OUT10) ; port OUT46
OUT47: U10.9(OUT11) ; port OUT47
OUT48: U10.10(OUT12) ; port OUT48
OUT49: U10.11(OUT13) ; port OUT49
OUT50: U10.12(OUT14) ; port OUT50
OUT51: U10.13(OUT15) ; port OUT51
OUT52: U10.14(OUT16) ; port OUT52
OUT53: U10.15(OUT17) ; port OUT53
OUT54: U10.16(OUT18) ; port OUT54
OUT55: U10.18(OUT19) ; port OUT55
OUT56: U10.19(OUT20) ; port OUT56
OUT57: U10.20(OUT21) ; port OUT57
OUT58: U10.21(OUT22) ; port OUT58
OUT59: U10.22(OUT23) ; port OUT59
OUT60: U10.23(OUT24) ; port OUT60
OUT61: U10.24(OUT25) ; port OUT61
OUT62: U10.25(OUT26) ; port OUT62
OUT63: U10.26(OUT27) ; port OUT63
OUT64: U10.27(OUT28) ; port OUT64
OUT65: U10.28(OUT29) ; port OUT65
OUT66: U10.29(OUT30) ; port OUT66
OUT67: U10.30(OUT31) ; port OUT67
OUT68: U10.31(OUT32) ; port OUT68
OUT69: U10.32(OUT33) ; port OUT69
OUT70: U10.33(OUT34) ; port OUT70
OUT71: U10.34(OUT35) ; port OUT71
OUT72: U10.35(OUT36) ; port OUT72
SCL: U2.42(SCL) U10.42(SCL) ; port SCL
SDA: U2.41(SDA) U10.41(SDA) ; port SDA
SDB: U2.36(SDB) U10.36(SDB) ; port SDB
NetD1_2: D1.2(Cathode) U4.2(OUT) U4.3(OUT) U4.5(OUT)
NetD2_2: D2.2(Cathode) U6.2(OUT) U6.3(OUT) U6.5(OUT)
NetQ1_3: Q1.3(D2) R7.1 TP112.1
NetQ2_3: Q2.3(D2) R11.1 TP113.1
NetQ2_6: Q2.6(D1) R14.1 TP110.1
NetR2_1: R2.1 TP157.1 U2.40(R_EXT)
NetR3_2: R3.2 TP97.1 U4.6(REXT)
NetR12_2: R12.2 TP98.1 U6.6(REXT)
NetR23_1: R23.1 TP156.1 U10.40(R_EXT)

### Notes on the sheet
- Imax = 19.5mA
- 100R, Iout = 20.6mA
- Logic Level (Vgs th max = 1.5V)
- PRELIMINARY: DO NOT USE FOR PRODUCTION
- Iled [15.63 - 20] mA
- Iled [10.91 - 20] mA
- Title
- Size:
- Date:
- B
- Author:
- Time:
- Sheet
- Revision:
- of
- File:

### Library data of the parts
C12 C37 = Varitron_CAP0402: as C51 on sheet 2_PWR; Tolerance: 10%; Technology: SMT; Temperature Coefficient: X7R; Part Number: CL05B104KO5NNNC; Value: 100 nF; Supplier: Arrow Electronics; Footprint Name: 0402
C15 C36 = Varitron_CAP0603: as C50 on sheet 2_PWR; Tolerance: 10%; Technology: SMT; Temperature Coefficient: X7R; Part Number: CL10B105KO8NNNC; Value: 1.0 uF; Supplier: Arrow Electronics; Footprint Name: 0603
D1 D2 = C503D-WAN-CDaEa232-0AH: Cree 5mm Round LED C503D-WAN-CDaEa232-0AH; pin to pad: A>1 C>2; SmartHalo Part Number: 630016-01; Final: Y; Manufacturer: Cree; Manufacturer Part Number: C503D-WAN-CDaEa232-0AH; Part Number: C503D-WAN-CDaEa232-0AH; Footprint Name: THROUGHHOLE(2 pins); Supplier: Arrow Electronics
Q1 Q2 = NX3020NAKV: 30 V, 200 mA dual N-channel Trench MOSFET; Manufacturer: NXP Semiconductors; SmartHalo Part Number: 630030-01; Final: Y; Manufacturer Part Number: NX3020NAKV; Part Number: NX3020NAKV; Footprint Name: SOT666; Supplier: Arrow Electronics
R2 R23 = Varitron_RES0402: 3k9 0.063W 5%  0402 (1005 Metric)  SMD; Manufacturer: Samsung; Manufacturer Part Number: RC1005J392CS; SmartHalo Part Number: 630034-01; Case-Metric: 1005; Case-EIA: 0402; Final: N; Tolerance: 5%; Technology: SMT; Power: 0.063W; Part Number: RC1005J392CS; Value: 3.9k Ohm; Footprint Name: 0402; Supplier: Arrow Electronics
R3 R12 = Varitron_RES0402: 100R 0.1W 5%  0402 (1005 Metric)  SMD; Manufacturer: Panasonic; Manufacturer Part Number: ERJ-2GEJ101X; SmartHalo Part Number: 630035-01; Case-Metric: 1005; Case-EIA: 0402; Final: N; Tolerance: 5%; Technology: SMT; Power: 0.1W; Part Number: ERJ-2GEJ101X; Value: 100 Ohm; Footprint Name: 0402; Supplier: Arrow Electronics
R7 = Varitron_RES0402: 160R 0.1W 5%  0402 (1005 Metric)  SMD; Manufacturer: Panasonic; Manufacturer Part Number: ERJ-2GEJ161X; SmartHalo Part Number: 630038-01; Case-Metric: 1005; Case-EIA: 0402; Final: N; Tolerance: 5%; Technology: SMT; Power: 0.1W; Part Number: ERJ-2GEJ161X; Value: 160 Ohm; Footprint Name: 0402; Supplier: Arrow Electronics
R11 R14 = Varitron_RES0402: 110R 0.1W 5%  0402 (1005 Metric)  SMD; Manufacturer: Panasonic; Manufacturer Part Number: ERJ-2GEJ111X; SmartHalo Part Number: 630042-01; Case-Metric: 1005; Case-EIA: 0402; Final: N; Tolerance: 5%; Technology: SMT; Power: 0.1W; Part Number: ERJ-2GEJ111X; Value: 110 Ohm; Footprint Name: 0402; Supplier: Arrow Electronics
TP96-TP98 TP107-TP110 TP112 TP113 TP156 TP157 = TESTPAD_TH_35mils: as TP1 on sheet 2_PWR
U2 U10 = IS31FL3236-QFLS2-TR: IC 36 CHANNELS LED DRIVER; Manufacturer: ISSI; SmartHalo Part Number: 630052-01; Final: Y; Manufacturer Part Number: IS31FL3236-QFLS2-TR; Part Number: IS31FL3236-QFLS2-TR; Footprint Name: QFN44TP; Supplier: Arrow Electronics
U4 U6 = IS31LT3171: 10-TO-150MA CONSTANT-CURRENT LED DRIVER; Manufacturer: ISSI; SmartHalo Part Number: 630054-01; Final: Y; Manufacturer Part Number: IS31LT3171; Part Number: IS31LT3171; Footprint Name: SOT23-6; Supplier: Arrow Electronics